# EAGLE design Super LED board (EAGLE 9.5.0)
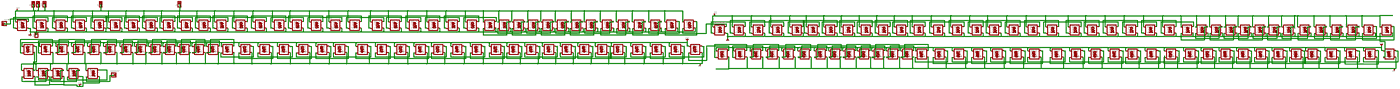
[diagram p0: schematic, sheet 1, overview]
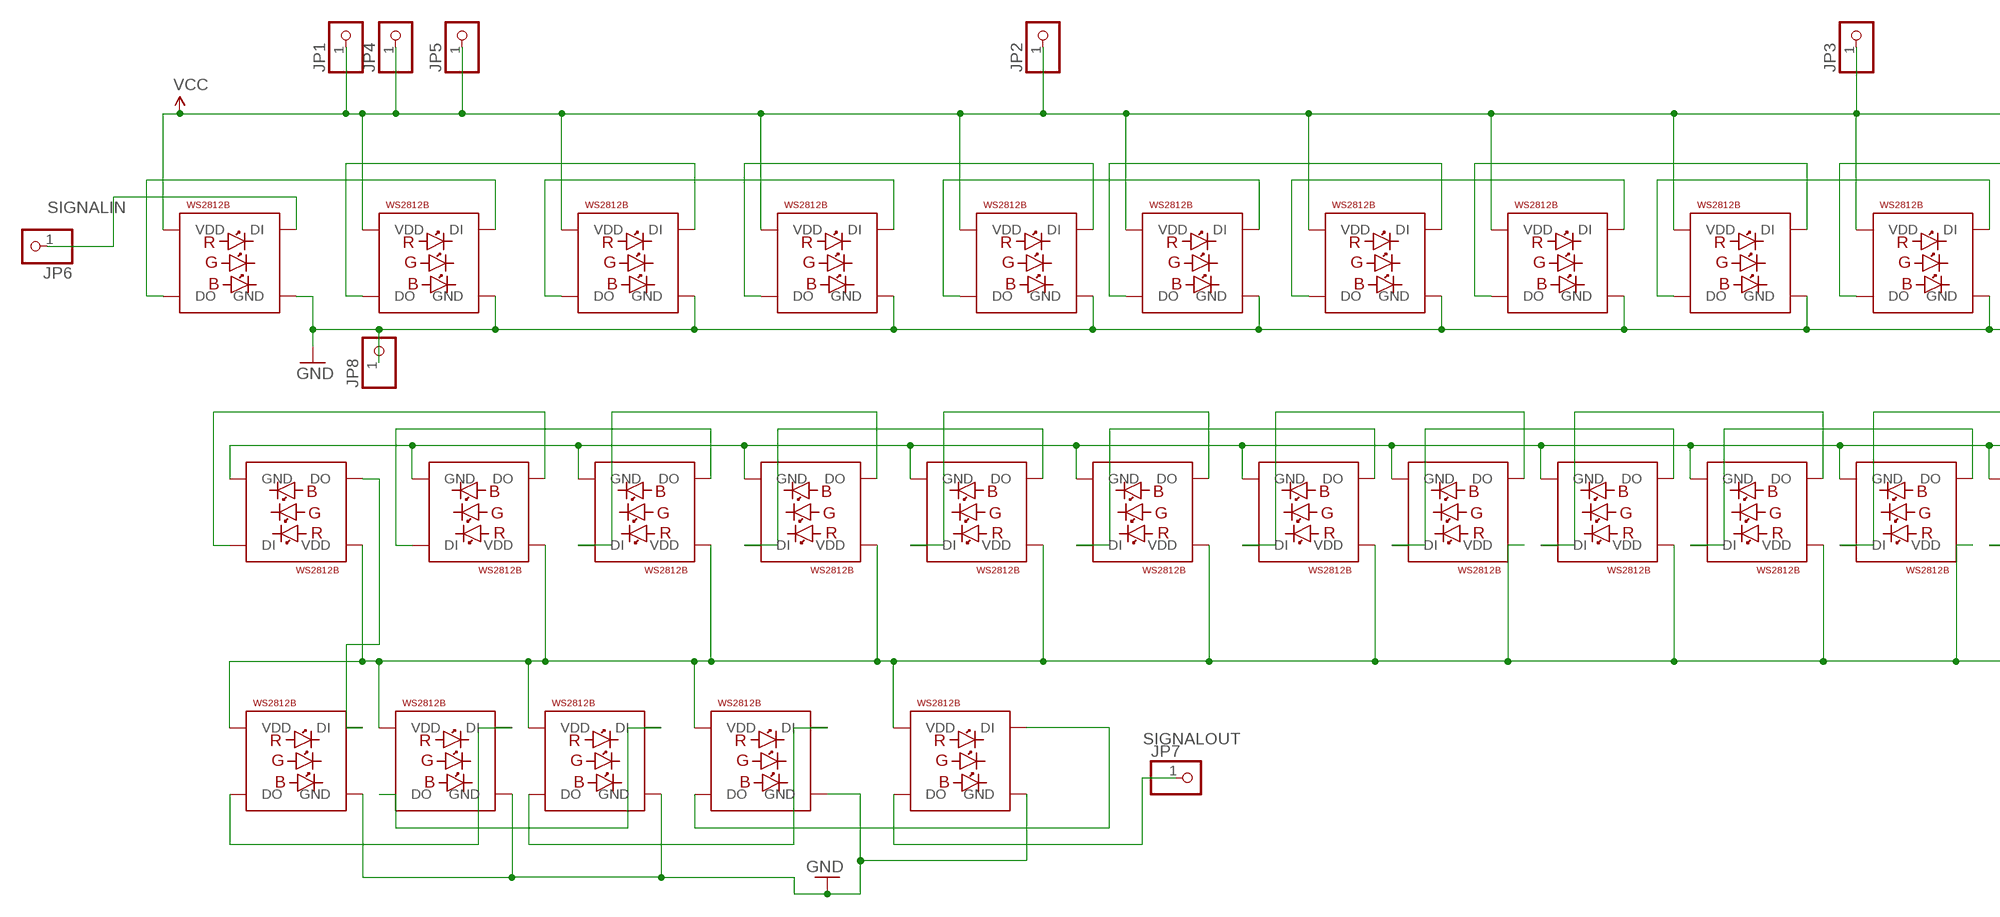
[diagram p1: schematic, sheet 1, part 1 of 8]
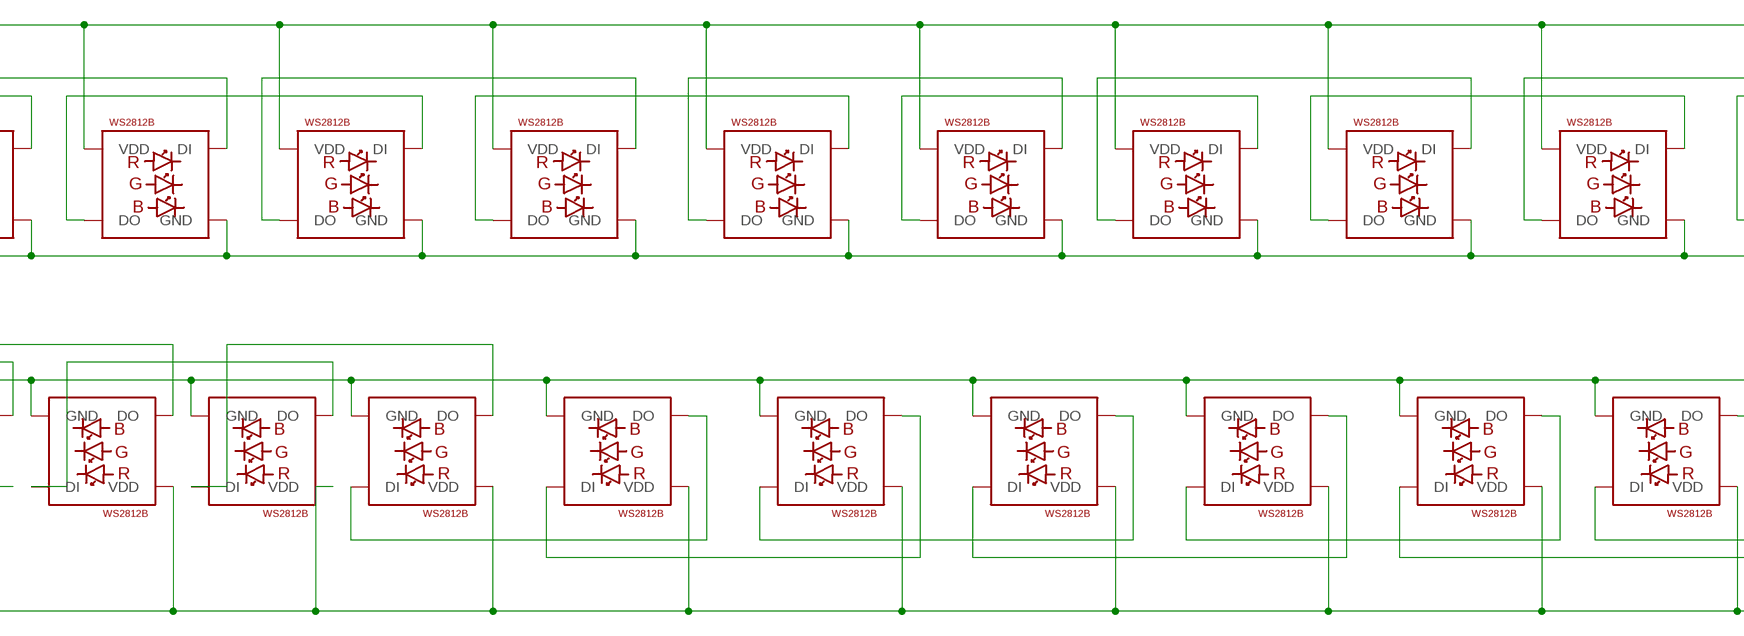
[diagram p2: schematic, sheet 1, part 2 of 8]
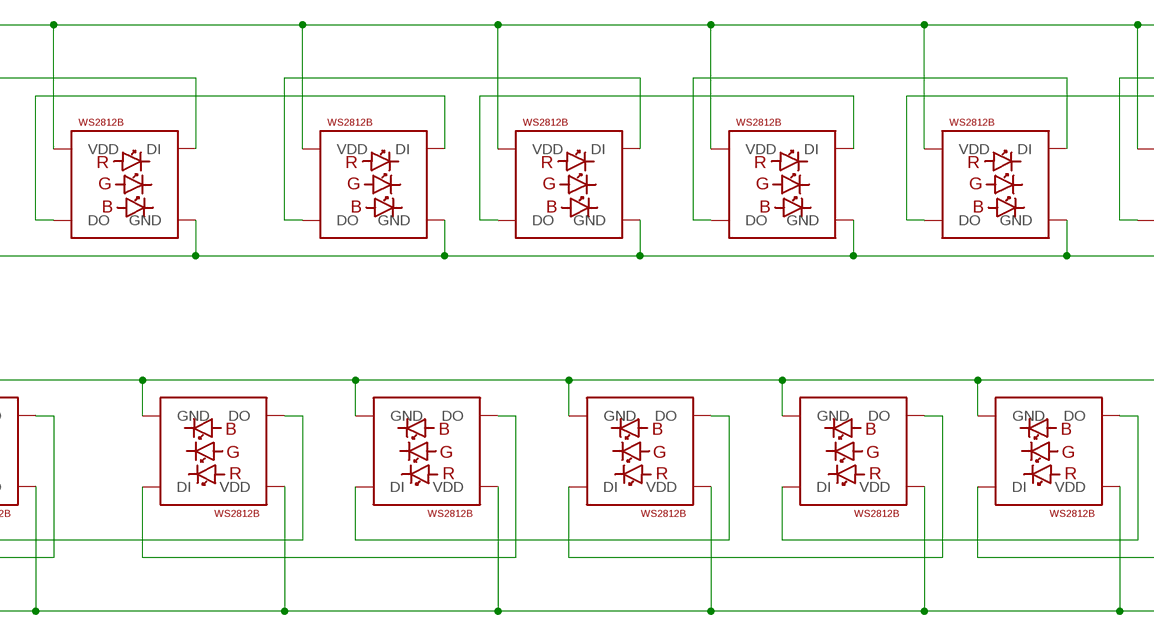
[diagram p3: schematic, sheet 1, part 3 of 8]
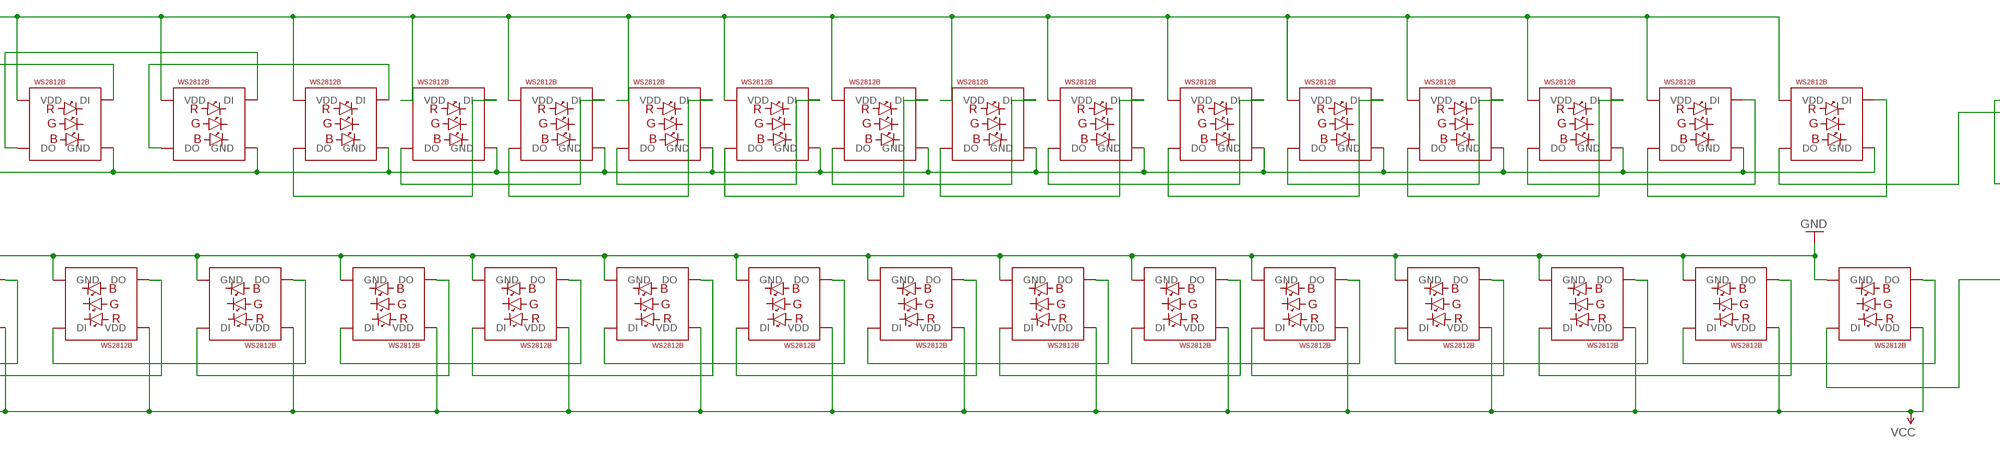
[diagram p4: schematic, sheet 1, part 4 of 8]
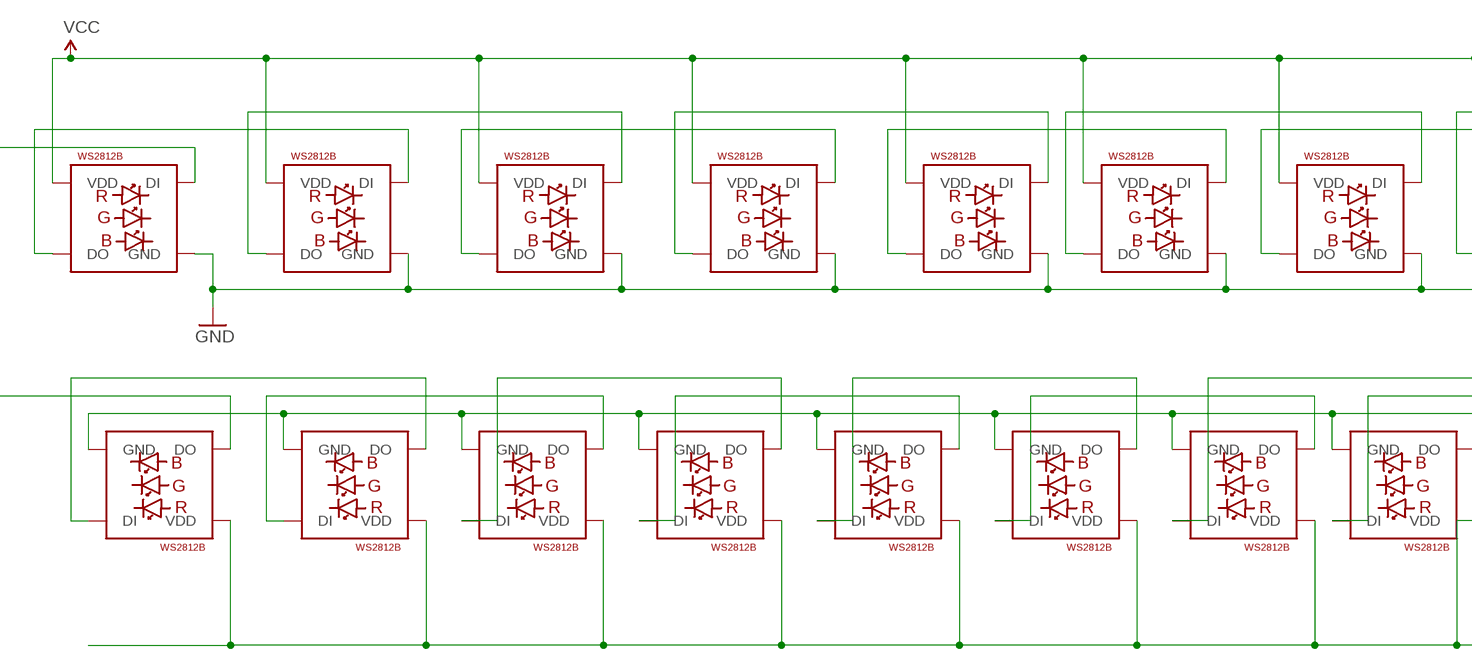
[diagram p5: schematic, sheet 1, part 5 of 8]
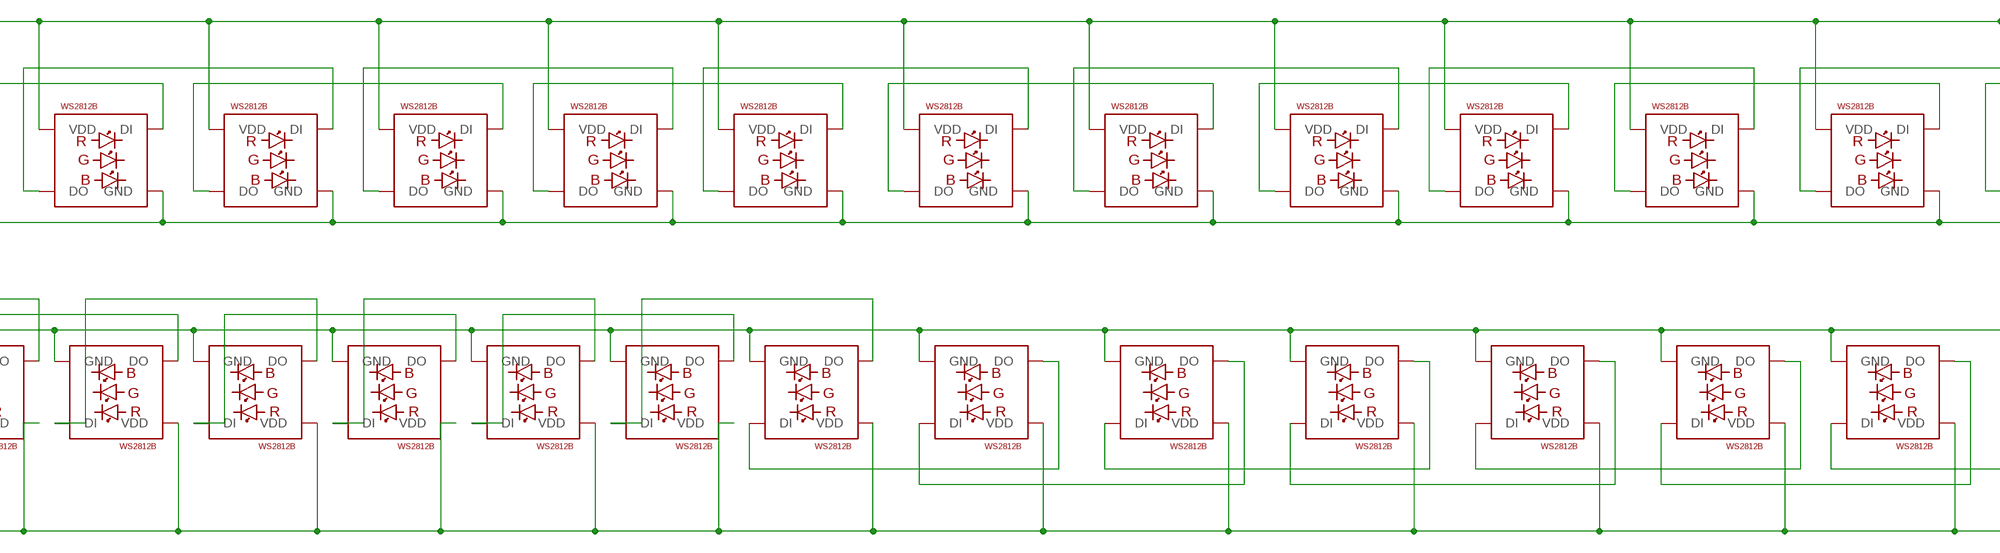
[diagram p6: schematic, sheet 1, part 6 of 8]
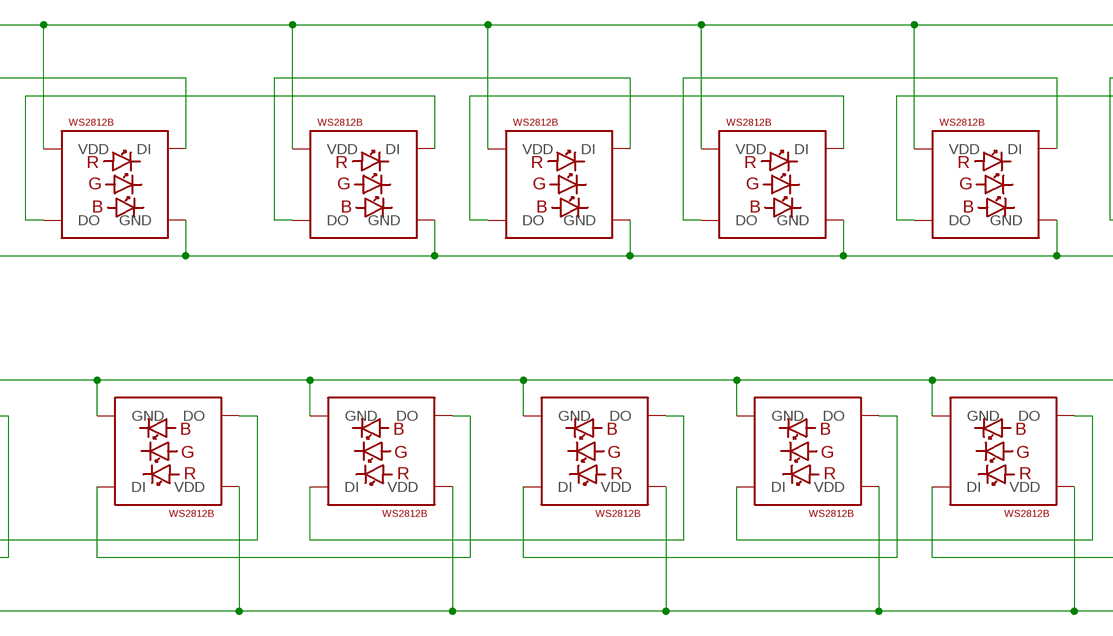
[diagram p7: schematic, sheet 1, part 7 of 8]
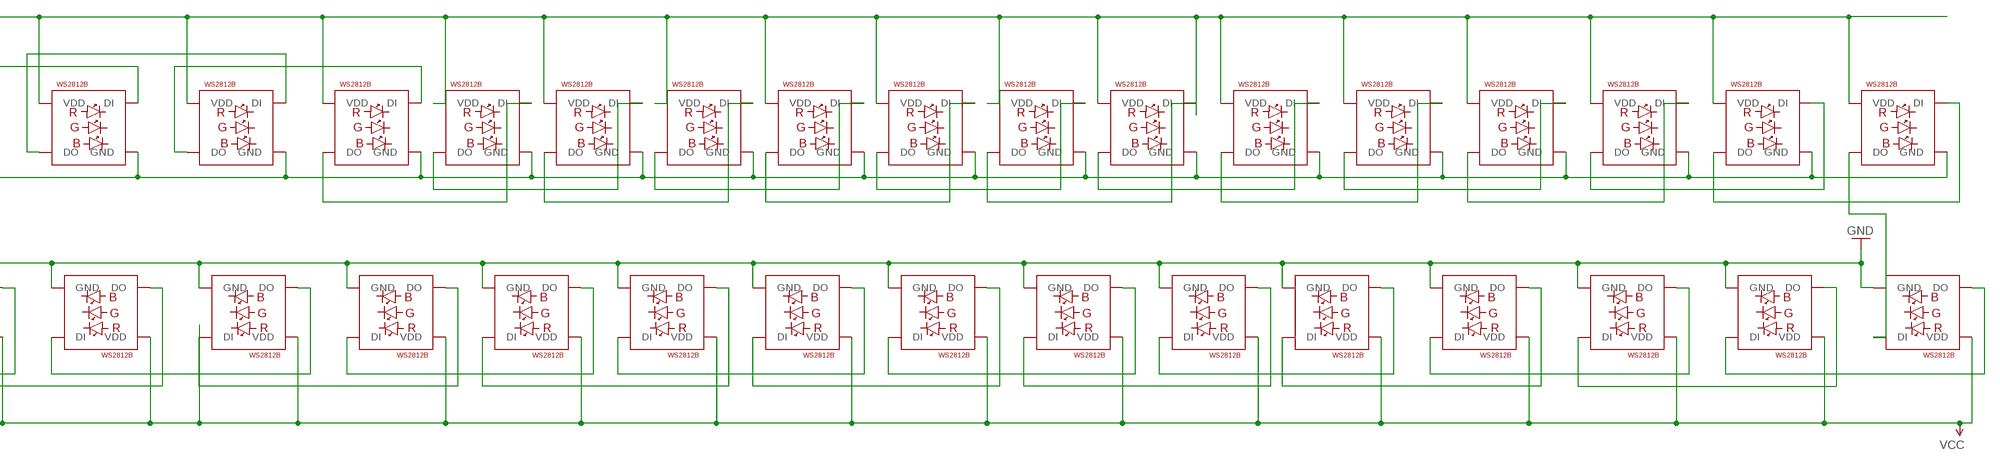
[diagram p8: schematic, sheet 1, part 8 of 8]

## Parts
JP1  PINHD-1X1  [1X01]
JP2  PINHD-1X1  [1X01]
JP3  PINHD-1X1  [1X01]
JP4  PINHD-1X1  [1X01]
JP5  PINHD-1X1  [1X01]
JP6  PINHD-1X1  [1X01]
JP7  PINHD-1X1  [1X01]
JP8  PINHD-1X1  [1X01]
LED1  WS2812B5050  [WS2812B]
LED2  WS2812B5050  [WS2812B]
LED3  WS2812B5050  [WS2812B]
LED4  WS2812B5050  [WS2812B]
LED5  WS2812B5050  [WS2812B]
LED6  WS2812B5050  [WS2812B]
LED7  WS2812B5050  [WS2812B]
LED8  WS2812B5050  [WS2812B]
LED9  WS2812B5050  [WS2812B]
LED10  WS2812B5050  [WS2812B]
LED11  WS2812B5050  [WS2812B]
LED12  WS2812B5050  [WS2812B]
LED13  WS2812B5050  [WS2812B]
LED14  WS2812B5050  [WS2812B]
LED15  WS2812B5050  [WS2812B]
LED16  WS2812B5050  [WS2812B]
LED17  WS2812B5050  [WS2812B]
LED18  WS2812B5050  [WS2812B]
LED19  WS2812B5050  [WS2812B]
LED20  WS2812B5050  [WS2812B]
LED21  WS2812B5050  [WS2812B]
LED22  WS2812B5050  [WS2812B]
LED23  WS2812B5050  [WS2812B]
LED24  WS2812B5050  [WS2812B]
LED25  WS2812B5050  [WS2812B]
LED26  WS2812B5050  [WS2812B]
LED27  WS2812B5050  [WS2812B]
LED28  WS2812B5050  [WS2812B]
LED29  WS2812B5050  [WS2812B]
LED30  WS2812B5050  [WS2812B]
LED31  WS2812B5050  [WS2812B]
LED32  WS2812B5050  [WS2812B]
LED33  WS2812B5050  [WS2812B]
LED34  WS2812B5050  [WS2812B]
LED35  WS2812B5050  [WS2812B]
LED36  WS2812B5050  [WS2812B]
LED37  WS2812B5050  [WS2812B]
LED38  WS2812B5050  [WS2812B]
LED39  WS2812B5050  [WS2812B]
LED40  WS2812B5050  [WS2812B]
LED41  WS2812B5050  [WS2812B]
LED42  WS2812B5050  [WS2812B]
LED43  WS2812B5050  [WS2812B]
LED44  WS2812B5050  [WS2812B]
LED45  WS2812B5050  [WS2812B]
LED46  WS2812B5050  [WS2812B]
LED47  WS2812B5050  [WS2812B]
LED48  WS2812B5050  [WS2812B]
LED49  WS2812B5050  [WS2812B]
LED50  WS2812B5050  [WS2812B]
LED51  WS2812B5050  [WS2812B]
LED52  WS2812B5050  [WS2812B]
LED53  WS2812B5050  [WS2812B]
LED54  WS2812B5050  [WS2812B]
LED55  WS2812B5050  [WS2812B]
LED56  WS2812B5050  [WS2812B]
LED57  WS2812B5050  [WS2812B]
LED58  WS2812B5050  [WS2812B]
LED59  WS2812B5050  [WS2812B]
LED60  WS2812B5050  [WS2812B]
LED61  WS2812B5050  [WS2812B]
LED62  WS2812B5050  [WS2812B]
LED63  WS2812B5050  [WS2812B]
LED64  WS2812B5050  [WS2812B]
LED65  WS2812B5050  [WS2812B]
LED66  WS2812B5050  [WS2812B]
LED67  WS2812B5050  [WS2812B]
LED68  WS2812B5050  [WS2812B]
LED69  WS2812B5050  [WS2812B]
LED70  WS2812B5050  [WS2812B]
LED71  WS2812B5050  [WS2812B]
LED72  WS2812B5050  [WS2812B]
LED73  WS2812B5050  [WS2812B]
LED74  WS2812B5050  [WS2812B]
LED75  WS2812B5050  [WS2812B]
LED76  WS2812B5050  [WS2812B]
LED77  WS2812B5050  [WS2812B]
LED78  WS2812B5050  [WS2812B]
LED79  WS2812B5050  [WS2812B]
LED80  WS2812B5050  [WS2812B]
LED81  WS2812B5050  [WS2812B]
LED82  WS2812B5050  [WS2812B]
LED83  WS2812B5050  [WS2812B]
LED84  WS2812B5050  [WS2812B]
LED85  WS2812B5050  [WS2812B]
LED86  WS2812B5050  [WS2812B]
LED87  WS2812B5050  [WS2812B]
LED88  WS2812B5050  [WS2812B]
LED89  WS2812B5050  [WS2812B]
LED90  WS2812B5050  [WS2812B]
LED91  WS2812B5050  [WS2812B]
LED92  WS2812B5050  [WS2812B]
LED93  WS2812B5050  [WS2812B]
LED94  WS2812B5050  [WS2812B]
LED95  WS2812B5050  [WS2812B]
LED96  WS2812B5050  [WS2812B]
LED97  WS2812B5050  [WS2812B]
LED98  WS2812B5050  [WS2812B]
LED99  WS2812B5050  [WS2812B]
LED100  WS2812B5050  [WS2812B]
LED101  WS2812B5050  [WS2812B]
LED102  WS2812B5050  [WS2812B]
LED103  WS2812B5050  [WS2812B]
LED104  WS2812B5050  [WS2812B]
LED105  WS2812B5050  [WS2812B]
LED106  WS2812B5050  [WS2812B]
LED107  WS2812B5050  [WS2812B]
LED108  WS2812B5050  [WS2812B]
LED109  WS2812B5050  [WS2812B]
LED110  WS2812B5050  [WS2812B]
LED111  WS2812B5050  [WS2812B]
LED112  WS2812B5050  [WS2812B]
LED113  WS2812B5050  [WS2812B]
LED114  WS2812B5050  [WS2812B]
LED115  WS2812B5050  [WS2812B]
LED116  WS2812B5050  [WS2812B]
LED117  WS2812B5050  [WS2812B]
LED118  WS2812B5050  [WS2812B]
LED119  WS2812B5050  [WS2812B]
LED120  WS2812B5050  [WS2812B]
LED121  WS2812B5050  [WS2812B]
LED122  WS2812B5050  [WS2812B]
LED123  WS2812B5050  [WS2812B]
LED124  WS2812B5050  [WS2812B]
LED125  WS2812B5050  [WS2812B]
LED126  WS2812B5050  [WS2812B]
LED127  WS2812B5050  [WS2812B]
LED128  WS2812B5050  [WS2812B]
LED129  WS2812B5050  [WS2812B]
LED130  WS2812B5050  [WS2812B]
LED131  WS2812B5050  [WS2812B]
LED132  WS2812B5050  [WS2812B]
LED133  WS2812B5050  [WS2812B]
LED134  WS2812B5050  [WS2812B]
LED135  WS2812B5050  [WS2812B]
LED136  WS2812B5050  [WS2812B]
LED137  WS2812B5050  [WS2812B]
LED138  WS2812B5050  [WS2812B]
LED139  WS2812B5050  [WS2812B]
LED140  WS2812B5050  [WS2812B]
LED141  WS2812B5050  [WS2812B]
LED142  WS2812B5050  [WS2812B]
LED143  WS2812B5050  [WS2812B]
LED144  WS2812B5050  [WS2812B]
LED145  WS2812B5050  [WS2812B]
LED146  WS2812B5050  [WS2812B]
LED147  WS2812B5050  [WS2812B]
LED148  WS2812B5050  [WS2812B]
LED149  WS2812B5050  [WS2812B]
LED150  WS2812B5050  [WS2812B]
LED151  WS2812B5050  [WS2812B]
LED152  WS2812B5050  [WS2812B]
LED153  WS2812B5050  [WS2812B]
LED154  WS2812B5050  [WS2812B]
LED155  WS2812B5050  [WS2812B]
LED156  WS2812B5050  [WS2812B]
LED157  WS2812B5050  [WS2812B]
LED158  WS2812B5050  [WS2812B]
LED159  WS2812B5050  [WS2812B]
LED160  WS2812B5050  [WS2812B]
LED161  WS2812B5050  [WS2812B]

## Nets
5V: JP1.1 JP2.1 JP3.1 JP4.1 JP5.1 LED1.1-VDD(VDD) LED2.1-VDD(VDD) LED3.1-VDD(VDD) LED4.1-VDD(VDD) LED5.1-VDD(VDD) LED6.1-VDD(VDD) LED7.1-VDD(VDD) LED8.1-VDD(VDD) LED9.1-VDD(VDD) LED10.1-VDD(VDD) LED11.1-VDD(VDD) LED12.1-VDD(VDD) LED13.1-VDD(VDD) LED14.1-VDD(VDD) LED15.1-VDD(VDD) LED16.1-VDD(VDD) LED17.1-VDD(VDD) LED18.1-VDD(VDD) LED19.1-VDD(VDD) LED20.1-VDD(VDD) LED21.1-VDD(VDD) LED22.1-VDD(VDD) LED23.1-VDD(VDD) LED24.1-VDD(VDD) LED25.1-VDD(VDD) LED26.1-VDD(VDD) LED27.1-VDD(VDD) LED28.1-VDD(VDD) LED29.1-VDD(VDD) LED30.1-VDD(VDD) LED31.1-VDD(VDD) LED32.1-VDD(VDD) LED33.1-VDD(VDD) LED34.1-VDD(VDD) LED35.1-VDD(VDD) LED36.1-VDD(VDD) LED37.1-VDD(VDD) LED38.1-VDD(VDD) LED39.1-VDD(VDD) LED40.1-VDD(VDD) LED41.1-VDD(VDD) LED42.1-VDD(VDD) LED43.1-VDD(VDD) LED44.1-VDD(VDD) LED45.1-VDD(VDD) LED46.1-VDD(VDD) LED47.1-VDD(VDD) LED48.1-VDD(VDD) LED49.1-VDD(VDD) LED50.1-VDD(VDD) LED51.1-VDD(VDD) LED52.1-VDD(VDD) LED53.1-VDD(VDD) LED54.1-VDD(VDD) LED55.1-VDD(VDD) LED56.1-VDD(VDD) LED57.1-VDD(VDD) LED58.1-VDD(VDD) LED59.1-VDD(VDD) LED60.1-VDD(VDD) LED61.1-VDD(VDD) LED62.1-VDD(VDD) LED63.1-VDD(VDD) LED64.1-VDD(VDD) LED65.1-VDD(VDD) LED66.1-VDD(VDD) LED67.1-VDD(VDD) LED68.1-VDD(VDD) LED69.1-VDD(VDD) LED70.1-VDD(VDD) LED71.1-VDD(VDD) LED72.1-VDD(VDD) LED73.1-VDD(VDD) LED74.1-VDD(VDD) LED75.1-VDD(VDD) LED76.1-VDD(VDD) LED77.1-VDD(VDD) LED78.1-VDD(VDD) LED79.1-VDD(VDD) LED80.1-VDD(VDD) LED81.1-VDD(VDD) LED82.1-VDD(VDD) LED83.1-VDD(VDD) LED84.1-VDD(VDD) LED85.1-VDD(VDD) LED86.1-VDD(VDD) LED87.1-VDD(VDD) LED88.1-VDD(VDD) LED89.1-VDD(VDD) LED90.1-VDD(VDD) LED91.1-VDD(VDD) LED92.1-VDD(VDD) LED93.1-VDD(VDD) LED94.1-VDD(VDD) LED95.1-VDD(VDD) LED96.1-VDD(VDD) LED97.1-VDD(VDD) LED98.1-VDD(VDD) LED99.1-VDD(VDD) LED100.1-VDD(VDD) LED101.1-VDD(VDD) LED102.1-VDD(VDD) LED103.1-VDD(VDD) LED104.1-VDD(VDD) LED105.1-VDD(VDD) LED106.1-VDD(VDD) LED107.1-VDD(VDD) LED108.1-VDD(VDD) LED109.1-VDD(VDD) LED110.1-VDD(VDD) LED111.1-VDD(VDD) LED112.1-VDD(VDD) LED113.1-VDD(VDD) LED114.1-VDD(VDD) LED115.1-VDD(VDD) LED116.1-VDD(VDD) LED117.1-VDD(VDD) LED118.1-VDD(VDD) LED119.1-VDD(VDD) LED120.1-VDD(VDD) LED121.1-VDD(VDD) LED122.1-VDD(VDD) LED123.1-VDD(VDD) LED124.1-VDD(VDD) LED125.1-VDD(VDD) LED126.1-VDD(VDD) LED127.1-VDD(VDD) LED128.1-VDD(VDD) LED129.1-VDD(VDD) LED130.1-VDD(VDD) LED131.1-VDD(VDD) LED132.1-VDD(VDD) LED133.1-VDD(VDD) LED134.1-VDD(VDD) LED135.1-VDD(VDD) LED136.1-VDD(VDD) LED137.1-VDD(VDD) LED138.1-VDD(VDD) LED139.1-VDD(VDD) LED140.1-VDD(VDD) LED141.1-VDD(VDD) LED142.1-VDD(VDD) LED143.1-VDD(VDD) LED144.1-VDD(VDD) LED145.1-VDD(VDD) LED146.1-VDD(VDD) LED147.1-VDD(VDD) LED148.1-VDD(VDD) LED149.1-VDD(VDD) LED150.1-VDD(VDD) LED151.1-VDD(VDD) LED152.1-VDD(VDD) LED153.1-VDD(VDD) LED154.1-VDD(VDD) LED155.1-VDD(VDD) LED156.1-VDD(VDD) LED157.1-VDD(VDD) LED158.1-VDD(VDD) LED159.1-VDD(VDD) LED160.1-VDD(VDD) LED161.1-VDD(VDD) ; supply symbol labelled VCC
GND: JP8.1 LED1.3-GND(GND) LED2.3-GND(GND) LED3.3-GND(GND) LED4.3-GND(GND) LED5.3-GND(GND) LED6.3-GND(GND) LED7.3-GND(GND) LED8.3-GND(GND) LED9.3-GND(GND) LED10.3-GND(GND) LED11.3-GND(GND) LED12.3-GND(GND) LED13.3-GND(GND) LED14.3-GND(GND) LED15.3-GND(GND) LED16.3-GND(GND) LED17.3-GND(GND) LED18.3-GND(GND) LED19.3-GND(GND) LED20.3-GND(GND) LED21.3-GND(GND) LED22.3-GND(GND) LED23.3-GND(GND) LED24.3-GND(GND) LED25.3-GND(GND) LED26.3-GND(GND) LED27.3-GND(GND) LED28.3-GND(GND) LED29.3-GND(GND) LED30.3-GND(GND) LED31.3-GND(GND) LED32.3-GND(GND) LED33.3-GND(GND) LED34.3-GND(GND) LED35.3-GND(GND) LED36.3-GND(GND) LED37.3-GND(GND) LED38.3-GND(GND) LED39.3-GND(GND) LED40.3-GND(GND) LED41.3-GND(GND) LED42.3-GND(GND) LED43.3-GND(GND) LED44.3-GND(GND) LED45.3-GND(GND) LED46.3-GND(GND) LED47.3-GND(GND) LED48.3-GND(GND) LED49.3-GND(GND) LED50.3-GND(GND) LED51.3-GND(GND) LED52.3-GND(GND) LED53.3-GND(GND) LED54.3-GND(GND) LED55.3-GND(GND) LED56.3-GND(GND) LED57.3-GND(GND) LED58.3-GND(GND) LED59.3-GND(GND) LED60.3-GND(GND) LED61.3-GND(GND) LED62.3-GND(GND) LED63.3-GND(GND) LED64.3-GND(GND) LED65.3-GND(GND) LED66.3-GND(GND) LED67.3-GND(GND) LED68.3-GND(GND) LED69.3-GND(GND) LED70.3-GND(GND) LED71.3-GND(GND) LED72.3-GND(GND) LED73.3-GND(GND) LED74.3-GND(GND) LED75.3-GND(GND) LED76.3-GND(GND) LED77.3-GND(GND) LED78.3-GND(GND) LED79.3-GND(GND) LED80.3-GND(GND) LED81.3-GND(GND) LED82.3-GND(GND) LED83.3-GND(GND) LED84.3-GND(GND) LED85.3-GND(GND) LED86.3-GND(GND) LED87.3-GND(GND) LED88.3-GND(GND) LED89.3-GND(GND) LED90.3-GND(GND) LED91.3-GND(GND) LED92.3-GND(GND) LED93.3-GND(GND) LED94.3-GND(GND) LED95.3-GND(GND) LED96.3-GND(GND) LED97.3-GND(GND) LED98.3-GND(GND) LED99.3-GND(GND) LED100.3-GND(GND) LED101.3-GND(GND) LED102.3-GND(GND) LED103.3-GND(GND) LED104.3-GND(GND) LED105.3-GND(GND) LED106.3-GND(GND) LED107.3-GND(GND) LED108.3-GND(GND) LED109.3-GND(GND) LED110.3-GND(GND) LED111.3-GND(GND) LED112.3-GND(GND) LED113.3-GND(GND) LED114.3-GND(GND) LED115.3-GND(GND) LED116.3-GND(GND) LED117.3-GND(GND) LED118.3-GND(GND) LED119.3-GND(GND) LED120.3-GND(GND) LED121.3-GND(GND) LED122.3-GND(GND) LED123.3-GND(GND) LED124.3-GND(GND) LED125.3-GND(GND) LED126.3-GND(GND) LED127.3-GND(GND) LED128.3-GND(GND) LED129.3-GND(GND) LED130.3-GND(GND) LED131.3-GND(GND) LED132.3-GND(GND) LED133.3-GND(GND) LED134.3-GND(GND) LED135.3-GND(GND) LED136.3-GND(GND) LED137.3-GND(GND) LED138.3-GND(GND) LED139.3-GND(GND) LED140.3-GND(GND) LED141.3-GND(GND) LED142.3-GND(GND) LED143.3-GND(GND) LED144.3-GND(GND) LED145.3-GND(GND) LED146.3-GND(GND) LED147.3-GND(GND) LED148.3-GND(GND) LED149.3-GND(GND) LED150.3-GND(GND) LED151.3-GND(GND) LED152.3-GND(GND) LED153.3-GND(GND) LED154.3-GND(GND) LED155.3-GND(GND) LED156.3-GND(GND) LED157.3-GND(GND) LED158.3-GND(GND) LED159.3-GND(GND) LED160.3-GND(GND) LED161.3-GND(GND)
N$1: LED5.2-DOUT(DO) LED6.4-DIN(DI)
N$2: LED1.2-DOUT(DO) LED2.4-DIN(DI)
N$3: LED2.2-DOUT(DO) LED3.4-DIN(DI)
N$4: LED3.2-DOUT(DO) LED4.4-DIN(DI)
N$5: LED4.2-DOUT(DO) LED5.4-DIN(DI)
N$6: LED6.2-DOUT(DO) LED7.4-DIN(DI)
N$7: LED7.2-DOUT(DO) LED8.4-DIN(DI)
N$8: LED8.2-DOUT(DO) LED9.4-DIN(DI)
N$9: LED9.2-DOUT(DO) LED10.4-DIN(DI)
N$10: LED10.2-DOUT(DO) LED11.4-DIN(DI)
N$11: LED11.2-DOUT(DO) LED12.4-DIN(DI)
N$12: LED12.2-DOUT(DO) LED13.4-DIN(DI)
N$13: LED13.2-DOUT(DO) LED14.4-DIN(DI)
N$14: LED14.2-DOUT(DO) LED15.4-DIN(DI)
N$15: LED15.2-DOUT(DO) LED16.4-DIN(DI)
N$16: LED16.2-DOUT(DO) LED17.4-DIN(DI)
N$17: LED17.2-DOUT(DO) LED18.4-DIN(DI)
N$18: LED18.2-DOUT(DO) LED19.4-DIN(DI)
N$19: LED19.2-DOUT(DO) LED20.4-DIN(DI)
N$20: LED20.2-DOUT(DO) LED21.4-DIN(DI)
N$21: LED21.2-DOUT(DO) LED22.4-DIN(DI)
N$22: LED22.2-DOUT(DO) LED23.4-DIN(DI)
N$23: LED23.2-DOUT(DO) LED24.4-DIN(DI)
N$24: LED24.2-DOUT(DO) LED25.4-DIN(DI)
N$25: LED25.2-DOUT(DO) LED26.4-DIN(DI)
N$26: LED26.2-DOUT(DO) LED27.4-DIN(DI)
N$27: LED27.2-DOUT(DO) LED28.4-DIN(DI)
N$28: LED28.2-DOUT(DO) LED29.4-DIN(DI)
N$29: LED29.2-DOUT(DO) LED30.4-DIN(DI)
N$30: LED30.2-DOUT(DO) LED31.4-DIN(DI)
N$31: LED31.2-DOUT(DO) LED32.4-DIN(DI)
N$32: LED32.2-DOUT(DO) LED33.4-DIN(DI)
N$33: LED33.2-DOUT(DO) LED34.4-DIN(DI)
N$34: LED34.2-DOUT(DO) LED35.4-DIN(DI)
N$35: LED35.2-DOUT(DO) LED36.4-DIN(DI)
N$36: LED36.2-DOUT(DO) LED37.4-DIN(DI)
N$37: LED37.2-DOUT(DO) LED38.4-DIN(DI)
N$38: LED38.2-DOUT(DO) LED39.4-DIN(DI)
N$39: LED40.2-DOUT(DO) LED41.4-DIN(DI)
N$40: LED42.2-DOUT(DO) LED43.4-DIN(DI)
N$41: LED43.2-DOUT(DO) LED44.4-DIN(DI)
N$42: LED44.2-DOUT(DO) LED45.4-DIN(DI)
N$43: LED45.2-DOUT(DO) LED46.4-DIN(DI)
N$44: LED46.2-DOUT(DO) LED47.4-DIN(DI)
N$45: LED47.2-DOUT(DO) LED48.4-DIN(DI)
N$46: LED48.2-DOUT(DO) LED49.4-DIN(DI)
N$47: LED49.2-DOUT(DO) LED50.4-DIN(DI)
N$48: LED50.2-DOUT(DO) LED51.4-DIN(DI)
N$49: LED51.2-DOUT(DO) LED52.4-DIN(DI)
N$50: LED52.2-DOUT(DO) LED53.4-DIN(DI)
N$51: LED53.2-DOUT(DO) LED54.4-DIN(DI)
N$52: LED54.2-DOUT(DO) LED55.4-DIN(DI)
N$53: LED55.2-DOUT(DO) LED56.4-DIN(DI)
N$54: LED56.2-DOUT(DO) LED57.4-DIN(DI)
N$55: LED57.2-DOUT(DO) LED58.4-DIN(DI)
N$56: LED58.2-DOUT(DO) LED59.4-DIN(DI)
N$57: LED59.2-DOUT(DO) LED60.4-DIN(DI)
N$58: LED60.2-DOUT(DO) LED61.4-DIN(DI)
N$59: LED61.2-DOUT(DO) LED62.4-DIN(DI)
N$60: LED62.2-DOUT(DO) LED63.4-DIN(DI)
N$61: LED63.2-DOUT(DO) LED64.4-DIN(DI)
N$62: LED64.2-DOUT(DO) LED65.4-DIN(DI)
N$63: LED41.2-DOUT(DO) LED42.4-DIN(DI)
N$64: LED65.2-DOUT(DO) LED66.4-DIN(DI)
N$65: LED66.2-DOUT(DO) LED67.4-DIN(DI)
N$66: LED67.2-DOUT(DO) LED68.4-DIN(DI)
N$67: LED68.2-DOUT(DO) LED69.4-DIN(DI)
N$68: LED69.2-DOUT(DO) LED70.4-DIN(DI)
N$69: LED70.2-DOUT(DO) LED71.4-DIN(DI)
N$70: LED71.2-DOUT(DO) LED72.4-DIN(DI)
N$71: LED72.2-DOUT(DO) LED73.4-DIN(DI)
N$72: LED73.2-DOUT(DO) LED74.4-DIN(DI)
N$73: LED74.2-DOUT(DO) LED75.4-DIN(DI)
N$74: LED75.2-DOUT(DO) LED76.4-DIN(DI)
N$75: LED76.2-DOUT(DO) LED77.4-DIN(DI)
N$76: LED77.2-DOUT(DO) LED78.4-DIN(DI)
N$77: LED39.2-DOUT(DO) LED40.4-DIN(DI)
N$78: LED79.2-DOUT(DO) LED80.4-DIN(DI)
N$79: LED81.2-DOUT(DO) LED82.4-DIN(DI)
N$80: LED82.2-DOUT(DO) LED83.4-DIN(DI)
N$81: LED83.2-DOUT(DO) LED84.4-DIN(DI)
N$82: LED84.2-DOUT(DO) LED85.4-DIN(DI)
N$83: LED85.2-DOUT(DO) LED86.4-DIN(DI)
N$84: LED86.2-DOUT(DO) LED87.4-DIN(DI)
N$85: LED87.2-DOUT(DO) LED88.4-DIN(DI)
N$86: LED88.2-DOUT(DO) LED89.4-DIN(DI)
N$87: LED89.2-DOUT(DO) LED90.4-DIN(DI)
N$88: LED90.2-DOUT(DO) LED91.4-DIN(DI)
N$89: LED91.2-DOUT(DO) LED92.4-DIN(DI)
N$90: LED92.2-DOUT(DO) LED93.4-DIN(DI)
N$91: LED93.2-DOUT(DO) LED94.4-DIN(DI)
N$92: LED94.2-DOUT(DO) LED95.4-DIN(DI)
N$93: LED95.2-DOUT(DO) LED96.4-DIN(DI)
N$94: LED96.2-DOUT(DO) LED97.4-DIN(DI)
N$95: LED97.2-DOUT(DO) LED98.4-DIN(DI)
N$96: LED98.2-DOUT(DO) LED99.4-DIN(DI)
N$97: LED99.2-DOUT(DO) LED100.4-DIN(DI)
N$98: LED100.2-DOUT(DO) LED101.4-DIN(DI)
N$99: LED101.2-DOUT(DO) LED102.4-DIN(DI)
N$100: LED102.2-DOUT(DO) LED103.4-DIN(DI)
N$101: LED103.2-DOUT(DO) LED104.4-DIN(DI)
N$102: LED80.2-DOUT(DO) LED81.4-DIN(DI)
N$103: LED104.2-DOUT(DO) LED105.4-DIN(DI)
N$104: LED105.2-DOUT(DO) LED106.4-DIN(DI)
N$105: LED106.2-DOUT(DO) LED107.4-DIN(DI)
N$106: LED107.2-DOUT(DO) LED108.4-DIN(DI)
N$107: LED108.2-DOUT(DO) LED109.4-DIN(DI)
N$108: LED109.2-DOUT(DO) LED110.4-DIN(DI)
N$109: LED110.2-DOUT(DO) LED111.4-DIN(DI)
N$110: LED111.2-DOUT(DO) LED112.4-DIN(DI)
N$111: LED112.2-DOUT(DO) LED113.4-DIN(DI)
N$112: LED113.2-DOUT(DO) LED114.4-DIN(DI)
N$113: LED114.2-DOUT(DO) LED115.4-DIN(DI)
N$114: LED115.2-DOUT(DO) LED116.4-DIN(DI)
N$115: LED116.2-DOUT(DO) LED117.4-DIN(DI)
N$116: LED78.2-DOUT(DO) LED79.4-DIN(DI)
N$117: LED118.2-DOUT(DO) LED119.4-DIN(DI)
N$118: LED120.2-DOUT(DO) LED121.4-DIN(DI)
N$119: LED121.2-DOUT(DO) LED122.4-DIN(DI)
N$120: LED122.2-DOUT(DO) LED123.4-DIN(DI)
N$121: LED123.2-DOUT(DO) LED124.4-DIN(DI)
N$122: LED124.2-DOUT(DO) LED125.4-DIN(DI)
N$123: LED125.2-DOUT(DO) LED126.4-DIN(DI)
N$124: LED126.2-DOUT(DO) LED127.4-DIN(DI)
N$125: LED127.2-DOUT(DO) LED128.4-DIN(DI)
N$126: LED128.2-DOUT(DO) LED129.4-DIN(DI)
N$127: LED129.2-DOUT(DO) LED130.4-DIN(DI)
N$128: LED130.2-DOUT(DO) LED131.4-DIN(DI)
N$129: LED131.2-DOUT(DO) LED132.4-DIN(DI)
N$130: LED132.2-DOUT(DO) LED133.4-DIN(DI)
N$131: LED133.2-DOUT(DO) LED134.4-DIN(DI)
N$132: LED134.2-DOUT(DO) LED135.4-DIN(DI)
N$133: LED135.2-DOUT(DO) LED136.4-DIN(DI)
N$134: LED136.2-DOUT(DO) LED137.4-DIN(DI)
N$135: LED137.2-DOUT(DO) LED138.4-DIN(DI)
N$136: LED138.2-DOUT(DO) LED139.4-DIN(DI)
N$137: LED139.2-DOUT(DO) LED140.4-DIN(DI)
N$138: LED140.2-DOUT(DO) LED141.4-DIN(DI)
N$139: LED141.2-DOUT(DO) LED142.4-DIN(DI)
N$140: LED142.2-DOUT(DO) LED143.4-DIN(DI)
N$141: LED119.2-DOUT(DO) LED120.4-DIN(DI)
N$142: LED143.2-DOUT(DO) LED144.4-DIN(DI)
N$143: LED144.2-DOUT(DO) LED145.4-DIN(DI)
N$144: LED145.2-DOUT(DO) LED146.4-DIN(DI)
N$145: LED146.2-DOUT(DO) LED147.4-DIN(DI)
N$146: LED147.2-DOUT(DO) LED148.4-DIN(DI)
N$147: LED148.2-DOUT(DO) LED149.4-DIN(DI)
N$148: LED149.2-DOUT(DO) LED150.4-DIN(DI)
N$149: LED150.2-DOUT(DO) LED151.4-DIN(DI)
N$150: LED151.2-DOUT(DO) LED152.4-DIN(DI)
N$151: LED152.2-DOUT(DO) LED153.4-DIN(DI)
N$152: LED153.2-DOUT(DO) LED154.4-DIN(DI)
N$153: LED154.2-DOUT(DO) LED155.4-DIN(DI)
N$154: LED155.2-DOUT(DO) LED156.4-DIN(DI)
N$155: LED117.2-DOUT(DO) LED118.4-DIN(DI)
N$156: LED160.2-DOUT(DO) LED161.4-DIN(DI)
N$157: LED156.2-DOUT(DO) LED157.4-DIN(DI)
N$158: LED157.2-DOUT(DO) LED158.4-DIN(DI)
N$159: LED158.2-DOUT(DO) LED159.4-DIN(DI)
N$160: LED159.2-DOUT(DO) LED160.4-DIN(DI)
SIGNALIN: JP6.1 LED1.4-DIN(DI)
SIGNALOUT: JP7.1 LED161.2-DOUT(DO)

## Library data of the parts
JP1-JP8 = adafruit:PINHD-1X1: Pin header 1x1 for 0.1" spacing With round pins
LED1-LED161 = freetronics-jon:WS2812B

## Board
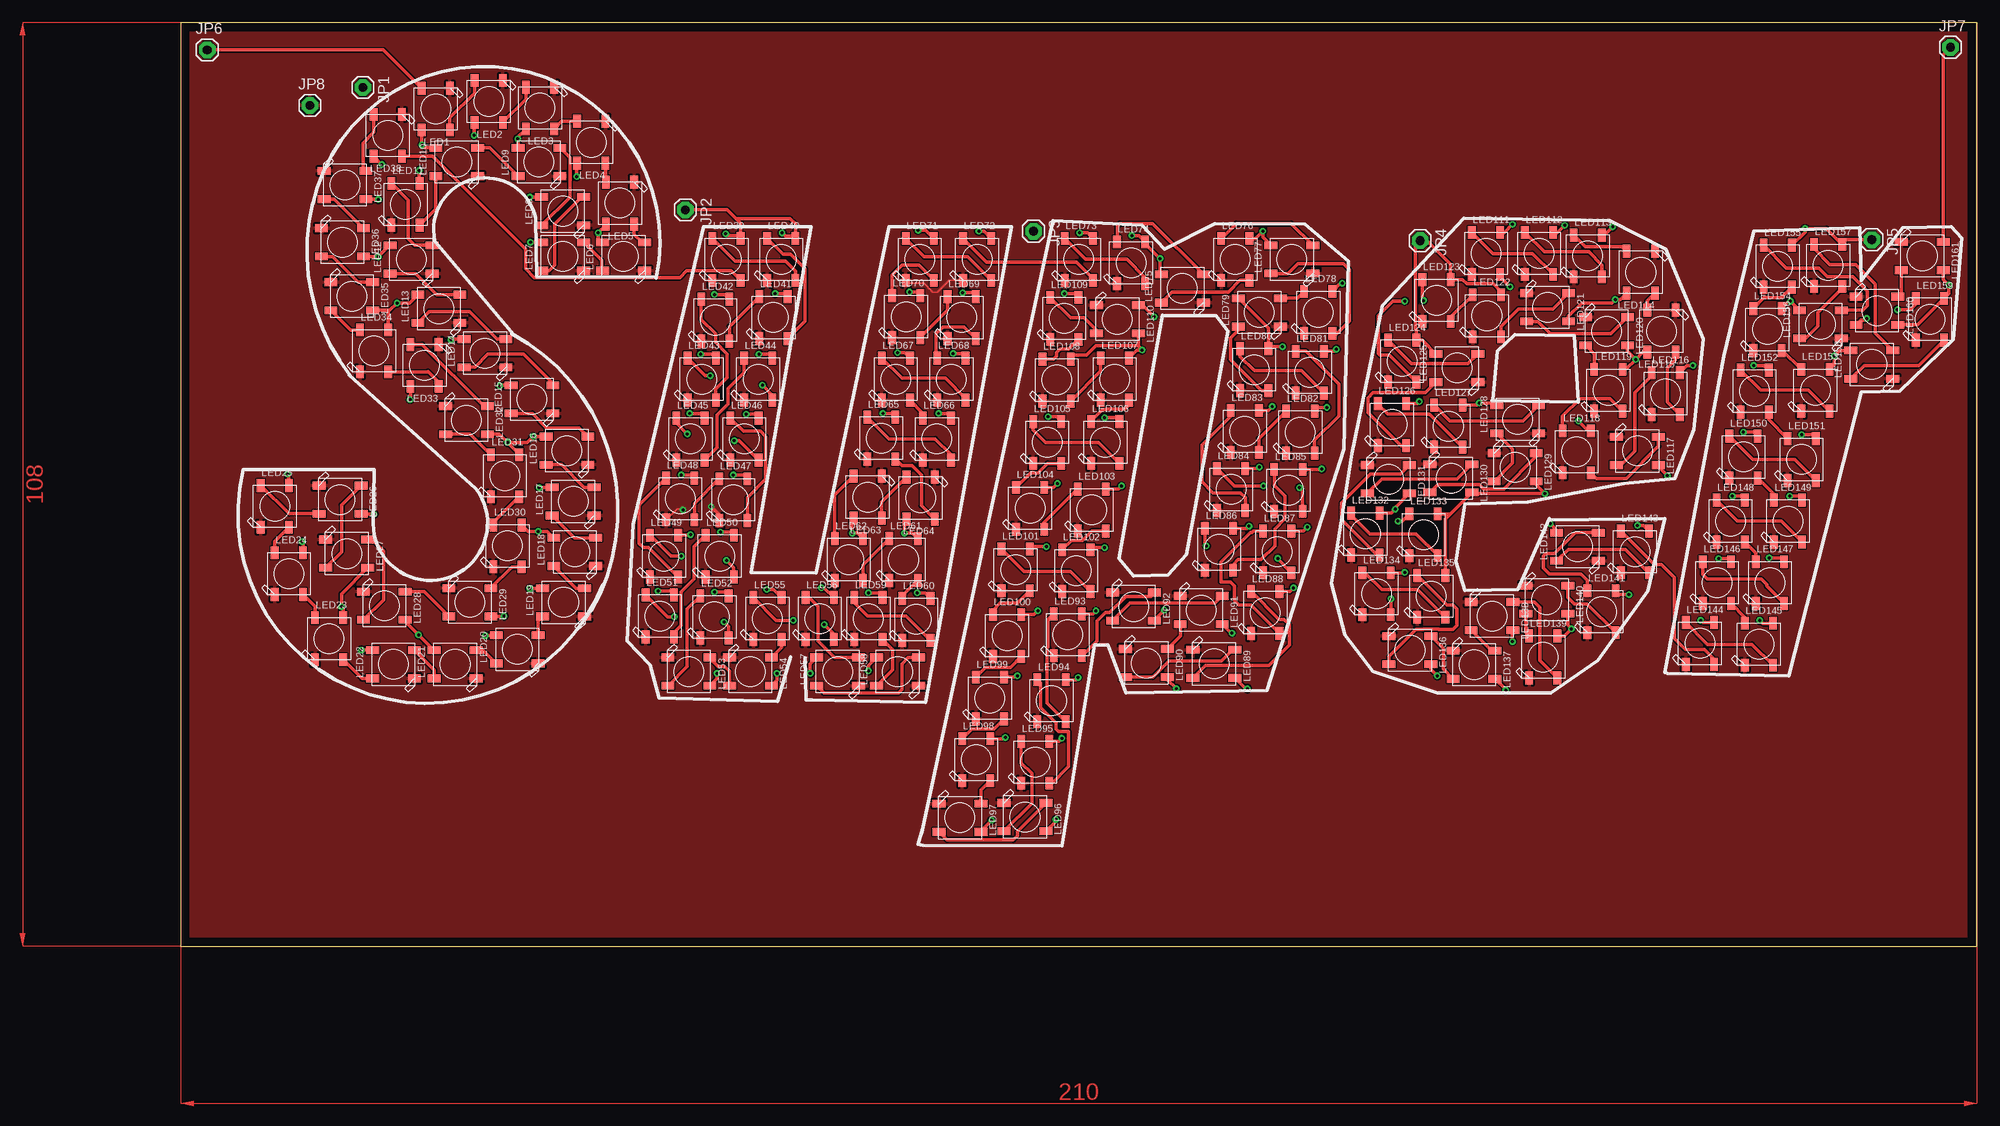
[diagram p9: board, top side]
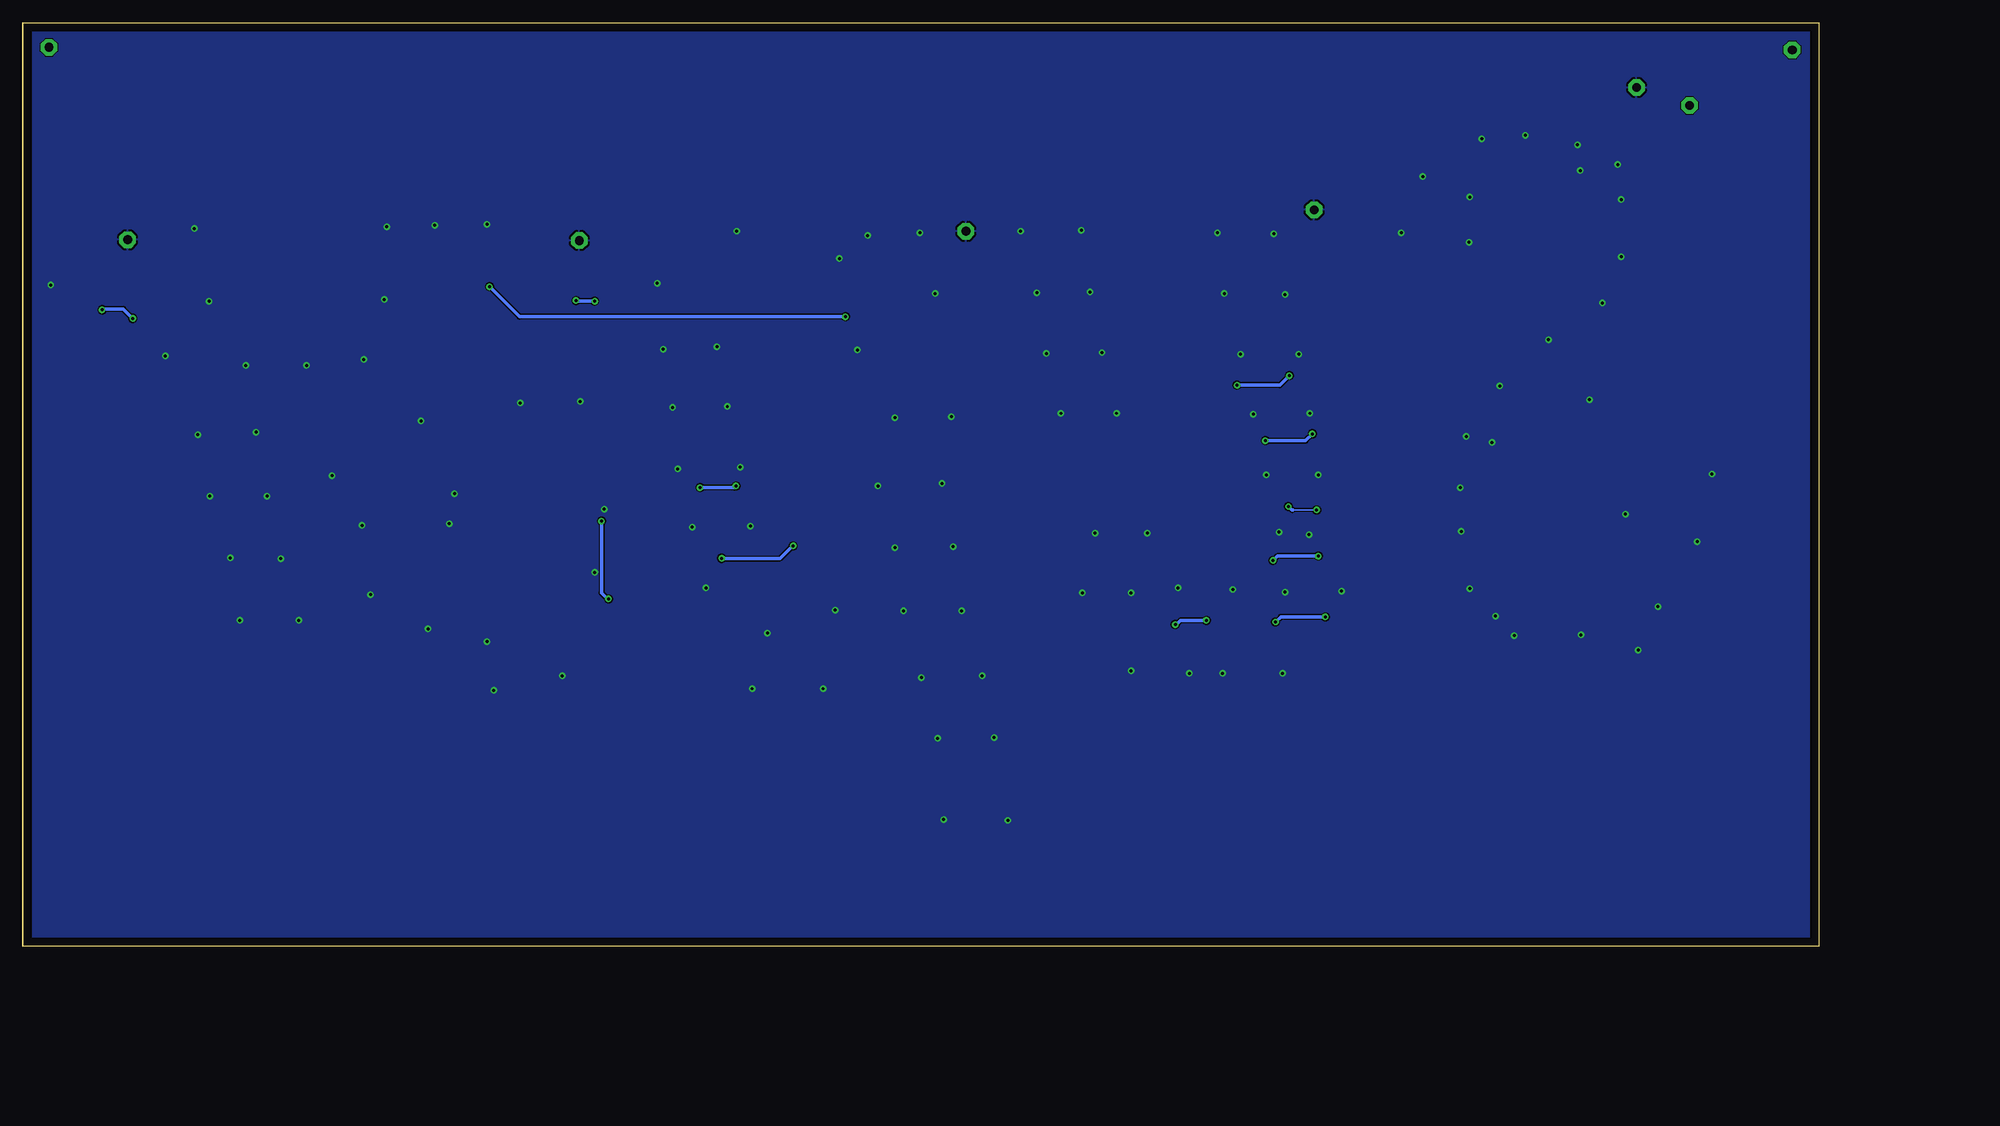
[diagram p10: board, bottom side, seen from below]

Size 210 x 108 mm. Coordinates in mm from the lower left corner, seen from the top.
Outline: 0,0 210,0 210,108 0,108 0,0
Copper layers (1*16): Top 0.035mm / dielectric 1.5mm / Bottom 0.035mm
Design rules "default": minimum track width 6mil, minimum drill 0.35mm, track to track 6mil, track to pad 6mil, pad to pad 6mil, via to via 6mil, smd to smd 6mil, copper to edge 40mil, drill to drill 6mil, minimum pad ring 10mil, minimum via ring 8mil, stop-mask expansion 4mil, vias tented up to drill 0mil, thermal gap 10mil

### Footprints (pad centres in the part's own frame; a part is rotated, then mirrored left to right if it is on the bottom)
1X01 = drill 1.016 pad 1.93 octagon: 1 0,0
WS2812B = smd 1.5 x 0.9: 1-VDD 2.45,-1.65; 2-DOUT 2.45,1.65; 3-GND -2.45,1.65; 4-DIN -2.45,-1.65

### Placement (x,y rotation side)
JP1  21.3,100.4 270 top
JP2  59,86.1 270 top
JP3  99.7,83.6 270 top
JP4  144.9,82.5 270 top
JP5  197.7,82.6 270 top
JP6  3.1,104.8 0 top
JP7  206.9,105.1 0 top
JP8  15.1,98.3 0 top
LED1  29.81,97.88 270 top
LED2  36.01,98.77 270 top
LED3  42,98 270 top
LED4  48,94 270 top
LED5  51.36,86.88 270 top
LED6  51.77,80.64 180 top
LED7  44.66,80.64 180 top
LED8  44.65,85.94 180 top
LED9  41.88,91.69 180 top
LED10  32.27,91.69 180 top
LED11  26.29,86.74 90 top
LED12  26.95,80.29 180 top
LED13  30.18,74.54 180 top
LED14  35.57,69.34 180 top
LED15  41.06,63.94 180 top
LED16  45.15,57.94 180 top
LED17  45.88,51.99 180 top
LED18  46.07,46.09 180 top
LED19  44.76,40.19 180 top
LED20  39.35,34.69 180 top
LED21  32.08,32.94 180 top
LED22  24.87,32.94 180 top
LED23  17.34,35.94 90 top
LED24  12.64,43.55 90 top
LED25  10.99,51.42 90 top
LED26  18.63,52.21 0 top
LED27  19.4,45.9 0 top
LED28  23.8,39.8 0 top
LED29  33.8,40.2 0 top
LED30  38.2,46.8 90 top
LED31  37.9,55 90 top
LED32  33.4,61.5 0 top
LED33  28.5,67.9 270 top
LED34  22.6,69.6 90 top
LED35  20,76 0 top
LED36  18.9,82.3 0 top
LED37  19.2,89 0 top
LED38  24.2,94.8 270 top
LED39  63.8,80.3 90 top
LED40  70.2,80.3 90 top
LED41  69.3,73.5 90 top
LED42  62.5,73.2 90 top
LED43  60.9,66.3 90 top
LED44  67.5,66.3 90 top
LED45  59.6,59.3 90 top
LED46  65.9,59.3 90 top
LED47  64.6,52.2 90 top
LED48  58.4,52.3 90 top
LED49  56.5,45.6 90 top
LED50  63,45.6 90 top
LED51  56,38.6 90 top
LED52  62.4,38.5 90 top
LED53  59.4,32.1 0 top
LED54  66.6,32.1 0 top
LED55  68.6,38.3 90 top
LED56  74.7,38.3 90 top
LED57  76.8,32.1 180 top
LED58  83.8,32.1 180 top
LED59  80.4,38.3 90 top
LED60  86,38.2 90 top
LED61  84.5,45.2 90 top
LED62  78.1,45.2 90 top
LED63  80.3,52.5 270 top
LED64  86.5,52.4 270 top
LED65  81.9,59.4 90 top
LED66  88.4,59.3 90 top
LED67  83.6,66.3 90 top
LED68  90.1,66.3 90 top
LED69  91.3,73.5 90 top
LED70  84.8,73.6 90 top
LED71  86.4,80.3 90 top
LED72  93.1,80.3 90 top
LED73  105,80.3 90 top
LED74  111.1,79.9 90 top
LED75  117.1,76.9 180 top
LED76  123.3,80.3 90 top
LED77  129.9,80.3 180 top
LED78  133,74.1 90 top
LED79  126.1,74.1 180 top
LED80  125.5,67.4 90 top
LED81  132,67.1 90 top
LED82  130.9,60.1 90 top
LED83  124.4,60.2 90 top
LED84  122.8,53.4 90 top
LED85  129.5,53.3 90 top
LED86  121.4,46.4 90 top
LED87  128.2,46.1 90 top
LED88  126.8,39 90 top
LED89  120.8,33 0 top
LED90  112.9,33.1 0 top
LED91  119.3,39.3 0 top
LED92  111.4,39.7 0 top
LED93  103.7,36.4 90 top
LED94  101.8,28.7 90 top
LED95  99.9,21.5 90 top
LED96  98.7,15.1 0 top
LED97  91.1,15 0 top
LED98  93,21.8 90 top
LED99  94.6,29 90 top
LED100  96.6,36.3 90 top
LED101  97.6,44 90 top
LED102  104.7,43.9 90 top
LED103  106.5,51 90 top
LED104  99.3,51.2 90 top
LED105  101.3,58.9 90 top
LED106  108.1,58.9 90 top
LED107  109.2,66.3 90 top
LED108  102.4,66.2 90 top
LED109  103.3,73.4 90 top
LED110  109.5,73.3 0 top
LED111  152.6,81 90 top
LED112  158.8,81 90 top
LED113  164.5,80.7 90 top
LED114  170.7,78.8 270 top
LED115  173.1,71.9 270 top
LED116  173.6,64.6 90 top
LED117  170.3,57.9 0 top
LED118  163.2,57.8 90 top
LED119  166.9,65 90 top
LED120  166.7,71.9 0 top
LED121  159.8,74.7 0 top
LED122  152.7,73.7 90 top
LED123  146.8,75.5 90 top
LED124  142.8,68.4 90 top
LED125  149.2,67.6 180 top
LED126  141.6,61 90 top
LED127  148.2,60.8 90 top
LED128  156.3,61.6 180 top
LED129  156,56 0 top
LED130  148.5,54.7 0 top
LED131  141.2,54.6 0 top
LED132  138.5,48.2 90 top
LED133  145.3,48.1 90 top
LED134  139.8,41.2 90 top
LED135  146.2,40.9 90 top
LED136  143.7,34.6 0 top
LED137  151.2,32.9 0 top
LED138  153.3,38.6 0 top
LED139  159.3,33.8 90 top
LED140  159.7,40.5 0 top
LED141  166.1,39.1 90 top
LED142  163.3,46.7 180 top
LED143  170,46.1 90 top
LED144  177.6,35.4 90 top
LED145  184.5,35.3 90 top
LED146  179.6,42.5 90 top
LED147  185.8,42.5 90 top
LED148  181.2,49.7 90 top
LED149  187.9,49.7 90 top
LED150  182.7,57.2 90 top
LED151  189.5,56.9 90 top
LED152  184,64.9 90 top
LED153  191.1,65 90 top
LED154  185.5,72.1 90 top
LED155  186.7,79.5 90 top
LED156  191.7,72.7 180 top
LED157  192.6,79.6 90 top
LED158  197.7,68 180 top
LED159  204.5,73.3 90 top
LED160  198.3,74.3 0 top
LED161  203.6,80.7 0 top

### Tracks (layer width: path | path; a pad name or v marks a point on that pad's centre or on a via)
5V  (via drill 0.35)
  Top 0.406: LED4.1-VDD 46.3,91.5 v46.3,90 | LED34.1-VDD 24.25,74.15 24.45,74.35 | LED35.1-VDD 24.45,74.35 | LED13.1-VDD 26.74,75.2 v25.3,75.2 24.45,74.35 | LED21.1-VDD 29.61,34.59 v27.8,36.4 26.25,37.95 LED28.1-VDD | LED39.1-VDD 65.45,83.1 | 65.45,83.1 65.45,84.55 64.95,85.05 | 64.95,85.05 63.9,86.1 JP2.1 | LED40.1-VDD 71.85,83 | 71.85,83 71.85,84.45 71.25,85.05 64.95,85.05 | LED5.1-VDD 49.71,84.31 v48.8,83.4 48.8,82.81 LED6.1-VDD | v40.9,82.3 v40.91,82.29 LED7.1-VDD | v40.8,87.6 LED8.1-VDD | LED9.1-VDD 39.43,94.37 v39.4,94.4 39.4,94.6 LED3.1-VDD | LED10.1-VDD 28.56,93.34 v28.2,93.7 28.16,93.74 LED1.1-VDD | LED11.1-VDD 27.9,89.23 v27.9,90.7 | LED37.1-VDD 23.05,87.35 v23.1,87.3 | LED36.1-VDD 21.4,80.6 v23.1,80.6 24.44,81.94 LED12.1-VDD | v31.6,70.9 31.69,70.99 LED14.1-VDD | v37.3,65.5 37.39,65.59 LED15.1-VDD | LED16.1-VDD v41.2,59.6 40.5,58.9 v38.2,58.9 | LED32.1-VDD 37.25,59.85 v38.2,58.9 | v38.2,58.9 39.55,57.55 LED31.1-VDD | v41.9,53.6 41.94,53.64 LED17.1-VDD | LED18.1-VDD 42.86,48.5 v41.8,48.5 40.6,48.5 LED30.1-VDD | v40.8,41.8 40.84,41.84 LED19.1-VDD | v37.8,38.6 37.75,38.55 LED29.1-VDD | v35.6,36.3 36.86,36.3 LED20.1-VDD | v21.1,34.6 LED22.1-VDD | LED23.1-VDD 18.99,39.51 v18.8,39.7 18.8,41.2 LED27.1-VDD | v14.2,47.3 14.29,47.21 LED24.1-VDD | v12.5,55.2 12.64,55.06 LED25.1-VDD | LED26.1-VDD 21.14,50.5 v22.6,50.5 | v62.4,76.2 63.6,76.2 LED42.1-VDD | v60.8,69.2 62.1,69.2 LED43.1-VDD | v66.1,62.2 67.1,62.2 LED46.1-VDD | v59.5,62.3 60.7,62.3 LED45.1-VDD | v58.5,55.1 59.7,55.1 LED48.1-VDD | v64.6,55.1 65.8,55.1 LED47.1-VDD | v63.1,48.4 64.3,48.4 LED50.1-VDD | v59.6,48.1 59.55,48.05 LED49.1-VDD | v62.4,41.4 63.6,41.4 LED52.1-VDD
  Top 0.406: v55.8,41.5 57.2,41.5 LED51.1-VDD | v62.7,31.9 62.7,31.3 LED53.1-VDD | v69.7,31.9 69.7,31.1 LED54.1-VDD | v68.5,41.7 69.3,41.7 LED55.1-VDD | v74.9,41.9 75.2,41.9 LED56.1-VDD | v80.4,41.3 81.5,41.3 LED59.1-VDD | v86.1,41.3 87,41.3 LED60.1-VDD | v80.4,32.2 80.4,32.8 LED58.1-VDD | v73.6,31.9 73.6,33 LED57.1-VDD | LED61.1-VDD 85.5,48.3 v84.6,48.3 84.6,49.7 LED64.1-VDD | LED62.1-VDD 79.1,48.3 v78.5,48.3 78.5,49.9 LED63.1-VDD | v82.1,62.3 83.1,62.3 LED65.1-VDD | v88.6,62.3 89.5,62.3 LED66.1-VDD | v90.3,69.3 91.2,69.3 LED68.1-VDD | v83.8,69.4 84.6,69.4 LED67.1-VDD | v85.2,76.5 86,76.5 LED70.1-VDD | v91.4,76.4 92.5,76.4 LED69.1-VDD | v86.2,83.7 87.1,83.7 LED71.1-VDD | v93.3,83.6 93.9,83.6 LED72.1-VDD | v63.7,83.3 63.9,83.1 65.45,83.1 | v70.3,83.4 70.7,83 71.85,83 | v105.1,83.4 106,83.4 LED73.1-VDD | v111.2,83.1 112,83.1 LED74.1-VDD 112.75,82.15 v114.5,80.4 114.5,78.7 LED75.1-VDD | v103.3,76.3 104.5,76.3 LED109.1-VDD | LED108.1-VDD 104.5,69.1 105.9,69.1 107,70.2 111.9,70.2 v112.4,69.7 | LED110.1-VDD 111.95,70.15 v112.4,69.7 | v112.4,69.7 111.8,69.7 LED107.1-VDD | LED76.1-VDD 125.65,82.75 v126.5,83.6 126.5,82.9 LED77.1-VDD | LED78.1-VDD 135.6,77.5 v135.8,77.5 | v135.1,69.8 134.85,69.55 LED81.1-VDD | v128.8,70.1 127.4,70.1 LED80.1-VDD 127.15,72.25 LED79.1-VDD | v127.6,63.1 127.15,62.65 LED83.1-VDD | LED82.1-VDD 133,63 v134,63 | v126.1,56 125.95,55.85 LED84.1-VDD | v133.4,55.8 133.35,55.75 LED85.1-VDD | v124.9,49.1 124.65,48.85 LED86.1-VDD | v131.7,49 131.25,48.55 LED87.1-VDD | v130.1,41.9 129.65,41.45 LED88.1-VDD | v124.7,30.1 124.5,30.1 LED89.1-VDD | v122.9,36.6 122.8,36.6 LED91.1-VDD | v116.4,30.1 115.35,31.15 LED90.1-VDD
  Top 0.406: v115,39.3 113.85,38.15 LED92.1-VDD | v107,39.2 106.65,38.85 LED93.1-VDD | v104.9,31.4 104.65,31.15 LED94.1-VDD | v103,24.3 102.65,23.95 LED95.1-VDD | v96.4,24.4 96.25,24.25 LED98.1-VDD | v94.8,14.7 93.55,13.45 LED97.1-VDD | v102.3,14.8 102.3,14.6 LED96.1-VDD | v97.8,31.6 97.65,31.45 LED99.1-VDD | v100.2,39.2 99.75,38.75 LED100.1-VDD | v101.2,46.7 99.5,46.7 LED101.1-VDD | v108,46.6 106.6,46.6 LED102.1-VDD | v110,53.8 109.65,53.45 LED103.1-VDD | v102.5,54.1 102.05,53.65 LED104.1-VDD | v101.4,61.9 102.4,61.9 LED105.1-VDD | v108,61.8 109.3,61.8 LED106.1-VDD | v155.7,84.4 154.75,83.45 LED111.1-VDD | v161.8,84.3 160.95,83.45 LED112.1-VDD | v167.4,84.1 166.45,83.15 LED113.1-VDD | LED122.1-VDD 154.35,76.55 153.46,77.44 150.35,77.44 149.85,77.95 LED123.1-VDD 148.45,79.75 145.7,82.5 JP4.1 144.34,81.94 144.34,72.15 144.45,72.05 LED124.1-VDD 145.15,70.85 LED125.1-VDD | LED114.1-VDD 168.3,75.6 v167.7,75.6 167.3,75.2 163.8,75.2 162.25,73.65 LED121.1-VDD | v170.1,68.6 169.15,69.55 LED120.1-VDD | v170.1,68.6 170.95,69.45 LED115.1-VDD | v170.1,68.6 168.95,67.45 LED119.1-VDD | LED116.1-VDD 176.1,67.9 v176.8,67.9 | LED117.1-VDD 172.75,56.05 v173.8,55 | v163.4,61.4 164.55,60.25 LED118.1-VDD | LED129.1-VDD 158.45,53.95 v159.5,52.9 151.1,52.9 LED130.1-VDD 148.45,50.55 | 148.45,50.55 LED133.1-VDD | LED132.1-VDD 141.55,50.65 v142,51.1 142,51.3 LED131.1-VDD | v143.1,43.7 143.05,43.65 LED134.1-VDD | 148.45,50.55 147.85,49.95 LED135.1-VDD | LED128.1-VDD 153.6,63.5 v151.8,63.5 151.55,63.25 LED127.1-VDD | v146.9,31.6 146.15,32.35 LED136.1-VDD | LED137.1-VDD 154.9,30 v154.9,29.9 | v155.7,35.6 155.7,36.9 LED138.1-VDD
  Top 0.406: LED139.1-VDD 161.75,36.25 v162.6,37.1 162.15,37.55 LED140.1-VDD | v170.3,49.2 171,49.2 LED143.1-VDD | v169.3,41.1 168.2,41.1 LED141.1-VDD | v160.1,49.4 160.85,48.65 LED142.1-VDD | v177.7,38.1 177.95,37.85 LED144.1-VDD | v184.6,38.1 184.95,37.75 LED145.1-VDD | v179.8,45.3 180.9,45.3 LED146.1-VDD | v185.7,45.4 187,45.4 LED147.1-VDD | v181.4,52.6 182.4,52.6 LED148.1-VDD | v188.1,52.6 189.1,52.6 LED149.1-VDD | v182.7,60.1 183.9,60.1 LED150.1-VDD | v189.5,59.8 190.7,59.8 LED151.1-VDD | LED153.1-VDD 193.3,68 v193.3,69 193.95,69.65 LED158.1-VDD | v183.9,67.9 185.1,67.9 LED152.1-VDD | LED156.1-VDD v188.2,75.4 188,75.4 LED154.1-VDD | LED160.1-VDD 203.05,72.65 LED159.1-VDD 206.7,76.3 v206.7,77.3 206.05,77.95 LED161.1-VDD | LED155.1-VDD 189.9,83.5 v189.9,83.9 192.4,83.9 194.1,82.2 | 194.1,82.2 LED157.1-VDD | JP5.1 194.5,82.6 194.1,82.2 | LED33.1-VDD 26.85,63.95 v26.8,63.9 | v144.8,63.7 144.55,63.45 LED126.1-VDD | v34.3,94.8 34.3,96.26 LED2.1-VDD | v69.5,76.3 70.6,76.3 LED41.1-VDD | v23.5,91.4 LED38.1-VDD | v67.6,69.2 68.7,69.2 LED44.1-VDD
  pour Bottom: 0,108 0,0 210,0 210,108
GND  (via drill 0.35)
  Top 0.152: LED48.3-GND 58,51.1 58.6,51.1 v58.7,51 | LED71.3-GND 85.1,77.5 86.9,77.5 87.37,77.03 87.37,77 87.5,76.87 87.53,76.87 87.9,76.5 88.5,76.5 89.85,77.85 LED72.3-GND
  Top 0.406: v62,51.4 62.95,50.45 LED47.3-GND
  Bottom 0.152: v58.7,51 61.5,51
  Bottom 0.406: v62,51.4 61.6,51 61.5,51
  pour Top: 0,108 0,0 210,0 210,108
N$1
  Top 0.406: LED5.2-DOUT 53.01,83.21 53,83.2 53.91,82.29 LED6.4-DIN
N$2
  Top 0.406: LED1.2-DOUT 31.46,96.86 34.36,99.76 LED2.4-DIN
N$3
  Top 0.406: LED2.2-DOUT 40.35,99.01 LED3.4-DIN
N$4
  Top 0.406: LED3.2-DOUT 44.55,96.45 LED4.4-DIN
N$5
  Top 0.406: LED5.4-DIN 49.65,89.39 LED4.2-DOUT
N$6
  Top 0.406: LED7.4-DIN 49.2,80.2 49.2,79.11 LED6.2-DOUT
N$7
  Top 0.406: LED8.4-DIN 46.89,87.59 43.7,84.4 43.7,79.6 43.09,78.99 LED7.2-DOUT
N$8
  Top 0.406: LED8.2-DOUT 45.5,87.59 45.5,92.17 LED9.4-DIN
N$9
  Top 0.406: LED10.4-DIN 36.13,93.34 LED9.2-DOUT
N$10
  Top 0.406: LED10.2-DOUT 29.82,86.17 LED11.4-DIN
N$11
  Top 0.406: LED11.2-DOUT 26.6,87.23 26.6,82.7 27.36,81.94 LED12.4-DIN
N$12
  Top 0.406: LED12.2-DOUT 27.46,78.64 29.91,76.19 LED13.4-DIN
N$13
  Top 0.406: LED14.4-DIN 37.01,70.99 33.8,74.2 29.04,74.2 LED13.2-DOUT
N$14
  Top 0.406: LED14.2-DOUT 34.39,67.69 35.9,69.2 40.1,69.2 43.51,65.79 LED15.4-DIN
N$15
  Top 0.406: LED15.2-DOUT 41.11,62.29 42.8,60.6 46.59,60.6 LED16.4-DIN
N$16
  Top 0.406: LED17.4-DIN 47.16,53.64 44.51,56.29 LED16.2-DOUT
N$17
  Top 0.406: LED18.4-DIN 46.03,47.74 LED17.2-DOUT
N$18
  Top 0.406: LED19.4-DIN 46.22,41.84 LED18.2-DOUT
N$19
  Top 0.406: LED20.4-DIN 41.8,38.03 LED19.2-DOUT
N$20
  Top 0.406: LED21.4-DIN 35.35,34.59 LED20.2-DOUT
N$21
  Top 0.406: LED22.4-DIN 29.63,32.28 LED21.2-DOUT
N$22
  Top 0.406: LED22.2-DOUT 21.19,31.29 LED23.4-DIN
N$23
  Top 0.406: LED24.4-DIN 15.69,39.7 LED23.2-DOUT
N$24
  Top 0.406: LED24.2-DOUT 10.99,47.32 LED25.4-DIN
N$25
  Top 0.406: LED26.4-DIN 12.65,50.56 LED25.2-DOUT
N$26
  Top 0.406: LED26.2-DOUT 18.8,51.58 18.8,46.1 LED27.4-DIN
N$27
  Top 0.406: LED28.4-DIN 23.7,40.5 23.7,46.2 22.35,47.55 LED27.2-DOUT
N$28
  Top 0.406: LED28.2-DOUT 28.45,41.45 LED29.4-DIN
N$29
  Top 0.406: LED29.2-DOUT 38.75,44.35 LED30.4-DIN
N$30
  Top 0.406: LED30.2-DOUT 36.55,49.55 LED31.4-DIN
N$31
  Top 0.406: LED32.4-DIN 33.85,59.85 LED31.2-DOUT
N$32
  Top 0.406: LED33.4-DIN 28.25,70.35 35.45,63.15 LED32.2-DOUT
N$33
  Top 0.406: LED34.4-DIN 28.85,67.15 28.9,67.2 30.15,65.95 LED33.2-DOUT
N$34
  Top 0.406: LED35.4-DIN 19.85,72.05 LED34.2-DOUT
N$35
  Top 0.406: LED36.4-DIN 17.75,80.65 20.75,77.65 LED35.2-DOUT
N$36
  Top 0.406: LED37.4-DIN 17.95,87.35 LED36.2-DOUT
N$37
  Top 0.406: LED38.4-DIN 22.55,95.15 21.3,93.9 21.3,91 LED37.2-DOUT
N$38
  Top 0.406: LED38.2-DOUT 29.45,92.35 40.3,81.5 40.3,79.2 41.31,78.18 58.38,78.18 59.16,78.96 64.34,78.96 LED39.4-DIN
N$39
  Top 0.406: LED40.2-DOUT 70.4,80.9 71.3,80.9 73,79.2 73,73.1 LED41.4-DIN
N$40
  Top 0.406: LED42.2-DOUT 60.85,73.25 62.5,71.6 62.5,70.6 63.9,69.2 63.9,66.5 62.55,65.15 LED43.4-DIN
N$41  (via drill 0.35)
  Top 0.406: LED43.2-DOUT 61.3,66.7 v61.9,66.7 | v68,65.6 69.15,64.45 LED44.4-DIN
  Bottom 0.406: v61.9,66.7 63,65.6 v68,65.6
N$42
  Top 0.406: LED44.2-DOUT 65.85,67.05 64,65.2 64,63.4 62.7,62.1 62.7,58.3 LED45.4-DIN
N$43  (via drill 0.35)
  Top 0.406: LED46.4-DIN 65.3,59.1 v64.7,59.1 | v59.2,59.9 57.95,61.15 LED45.2-DOUT
  Bottom 0.406: v64.7,59.1 60,59.1 v59.2,59.9
N$44
  Top 0.406: LED47.4-DIN 66.25,52.45 68.4,54.6 68.4,59.6 67.8,60.2 65.8,60.2 LED46.2-DOUT
N$45
  Top 0.406: LED48.4-DIN 60.05,51.75 LED47.2-DOUT
N$46
  Top 0.406: LED49.4-DIN 54.7,46.6 54.1,46.6 53.6,47.1 53.6,51.6 LED48.2-DOUT
N$47  (via drill 0.35)
  Top 0.406: LED49.2-DOUT 57.3,45.6 v58.5,45.6 | v63.8,45.1 64.65,44.25 LED50.4-DIN
  Bottom 0.406: v58.5,45.6 63.3,45.6 v63.8,45.1
N$48
  Top 0.406: LED51.4-DIN 57.65,36.65 58.5,37.5 58.5,41.4 60,42.9 60,46.7 LED50.2-DOUT
N$49  (via drill 0.35)
  Top 0.406: LED51.2-DOUT 56.9,38.5 v57.7,38.5 | v63.5,37.9 64.05,37.35 LED52.4-DIN
  Bottom 0.406: v57.7,38.5 62.9,38.5 v63.5,37.9
N$50
  Top 0.406: LED53.4-DIN 59.2,32.7 59.2,39.4 LED52.2-DOUT
N$51
  Top 0.406: LED54.4-DIN 64.15,32.15 63.6,32.7 62.8,32.7 61.85,33.65 LED53.2-DOUT
N$52
  Top 0.406: LED54.2-DOUT 70.25,34.95 LED55.4-DIN
N$53  (via drill 0.35)
  Top 0.406: LED55.2-DOUT 69.6,38.1 v71.6,38.1 | v75.23,37.6 76.35,36.48 LED56.4-DIN
  Bottom 0.406: v71.6,38.1 74.6,38.1 75.1,37.6 v75.23,37.6
N$54
  Top 0.406: LED57.4-DIN 76.45,33.75 74.5,35.7 74.5,39.7 73.45,40.75 LED56.2-DOUT
N$55
  Top 0.406: LED57.2-DOUT 75.2,29.6 83.9,29.6 84.3,30 84.3,33 85.05,33.75 LED58.4-DIN
N$56
  Top 0.406: LED59.4-DIN 83.2,34.7 83.2,32.3 LED58.2-DOUT
N$57
  Top 0.406: LED60.4-DIN 84.8,38.6 80.3,38.6 78.75,40.15 LED59.2-DOUT
N$58
  Top 0.406: LED60.2-DOUT 84.35,40.95 LED61.4-DIN
N$59
  Top 0.406: LED62.4-DIN 79.75,44.55 LED61.2-DOUT
N$60
  Top 0.406: LED63.4-DIN 76.45,52.75 LED62.2-DOUT
N$61
  Top 0.406: LED63.2-DOUT 81.95,51.95 LED64.4-DIN
N$62
  Top 0.406: LED65.4-DIN 84.3,56.2 85.5,56.2 86.6,55.1 86.6,51.5 LED64.2-DOUT
N$63
  Top 0.406: LED41.2-DOUT 64.15,72.45 LED42.4-DIN
N$64
  Top 0.406: LED65.2-DOUT 82.8,59.3 88.2,59.3 90.05,57.45 LED66.4-DIN
N$65
  Top 0.406: LED67.4-DIN 86.75,62.35 LED66.2-DOUT
N$66
  Top 0.406: LED67.2-DOUT 84.3,66.4 89.4,66.4 91.75,64.05 LED68.4-DIN
N$67
  Top 0.406: LED69.4-DIN 91.6,72.4 89.1,72.4 88.3,71.6 88.3,68.9 LED68.2-DOUT
N$68
  Top 0.406: LED69.2-DOUT 89.65,74.35 LED70.4-DIN
N$69
  Top 0.406: LED71.4-DIN 86.3,79.6 84.3,79.6 83.15,78.45 LED70.2-DOUT
N$70
  Top 0.406: LED71.2-DOUT 86.9,80.6 92,80.6 LED72.4-DIN
N$71
  Top 0.406: LED72.2-DOUT 94.2,80 104.7,80 106.65,78.05 LED73.4-DIN
N$72
  Top 0.406: LED73.2-DOUT 105.8,80.3 110.6,80.3 112.75,78.15 LED74.4-DIN
N$73
  Top 0.406: LED74.2-DOUT 109.5,82.4 109.5,84.2 109.8,84.5 113.6,84.5 LED75.4-DIN
N$74
  Top 0.406: LED75.2-DOUT 115.9,76.5 122.5,76.5 123.85,77.85 LED76.4-DIN
N$75
  Top 0.406: LED76.2-DOUT 123.4,84.5 129.8,84.5 LED77.4-DIN
N$76
  Top 0.406: LED77.2-DOUT 129.45,78.65 130.6,79.8 135.9,79.8 136.6,79.1 136.6,73.1 135.15,71.65 LED78.4-DIN
N$77
  Top 0.406: LED39.2-DOUT 64.8,80.1 70.7,80.1 71.85,78.95 LED40.4-DIN
N$78
  Top 0.406: LED79.2-DOUT 123.65,72.05 122.7,71.1 122.7,68.6 126.35,64.95 LED80.4-DIN
N$79
  Top 0.406: LED82.4-DIN 132.55,59.15 135.4,62 135.4,65.7 131.55,69.55 LED81.2-DOUT
N$80
  Top 0.406: LED82.2-DOUT 126.05,59.35 LED83.4-DIN
N$81
  Top 0.406: LED83.2-DOUT 122.75,61.95 119.4,58.6 119.4,54.3 120.7,53 123.9,53 124.45,52.45 LED84.4-DIN
N$82  (via drill 0.35)
  Top 0.406: LED84.2-DOUT 123.2,53.8 v126.6,53.8 | v130.8,53.6 131.15,53.25 LED85.4-DIN
  Bottom 0.406: v126.6,53.8 126.8,53.6 v130.8,53.6
N$83
  Top 0.406: LED85.2-DOUT 127.85,53.85 129.1,52.6 129.1,50 127.9,48.8 127.9,46.8 126.3,45.2 123.6,45.2 123.05,44.65 LED86.4-DIN
N$84  (via drill 0.35)
  Top 0.406: LED87.4-DIN 128.2,45.3 v128.25,45.35 | v119.9,46.8 119.75,46.95 LED86.2-DOUT
  Bottom 0.406: v128.25,45.35 121.45,45.35 120,46.8 v119.9,46.8
N$85
  Top 0.406: LED88.4-DIN 125.1,39.9 123.7,39.9 123.2,40.4 123.2,42.1 122.7,42.6 121.6,42.6 121.6,44.9 125.07,48.37 125.2,48.37 125.39,48.55 LED87.2-DOUT
N$86
  Top 0.406: LED88.2-DOUT 128.4,38.2 129,38.2 129.6,37.6 129.6,35.2 127.2,32.8 119.8,32.8 LED89.4-DIN
N$87
  Top 0.406: LED89.2-DOUT 122.95,34.65 121.66,33.36 115.56,33.36 113.65,31.45 LED90.4-DIN
N$88
  Top 0.406: LED91.4-DIN 116.85,36.25 LED90.2-DOUT
N$89
  Top 0.406: LED91.2-DOUT 120.9,40.1 111,40.1 LED92.4-DIN
N$90
  Top 0.406: LED92.2-DOUT 113.4,40.9 110.5,40.9 108.6,39 108.1,39 107.1,38 107.1,35.7 LED93.4-DIN
N$91
  Top 0.406: LED94.4-DIN 101.24,28.46 101.24,34.85 101.4,35 101.4,38.2 LED93.2-DOUT
N$92
  Top 0.406: LED94.2-DOUT 100.5,30.8 100.5,27.9 102.3,26.1 102.3,25.4 102.6,25.1 103.8,25.1 103.8,21 101.85,19.05 LED95.4-DIN
N$93
  Top 0.406: LED95.2-DOUT 98.25,21.45 99.5,20.2 99.5,16.7 LED96.4-DIN
N$94
  Top 0.406: LED96.2-DOUT 97.8,13.4 97.8,12.9 97.3,12.4 89.6,12.4 LED97.4-DIN
N$95
  Top 0.406: LED97.2-DOUT 93.55,18.25 LED98.4-DIN
N$96
  Top 0.406: LED98.2-DOUT 92.5,25.4 95.1,25.4 LED99.4-DIN
N$97
  Top 0.406: LED99.2-DOUT 94.1,32.6 97,32.6 LED100.4-DIN
N$98
  Top 0.406: LED101.4-DIN 97.8,40.1 95.8,40.1 94.95,39.25 LED100.2-DOUT
N$99
  Top 0.406: LED102.4-DIN 104,43.8 98.6,43.8 LED101.2-DOUT
N$100
  Top 0.406: LED103.4-DIN 106.55,48.55 105.45,47.44 104.14,47.44 LED102.2-DOUT
N$101
  Top 0.406: LED104.4-DIN 100.95,49.55 LED103.2-DOUT
N$102
  Top 0.406: LED81.4-DIN 131,67.3 125.5,67.3 123.85,68.95 LED80.2-DOUT
N$103
  Top 0.406: LED104.2-DOUT 99.34,55.34 100.25,55.34 101.35,56.45 LED105.4-DIN
N$104
  Top 0.406: LED106.4-DIN 107.3,58.9 101.1,58.9 99.65,60.35 LED105.2-DOUT
N$105
  Top 0.406: LED106.2-DOUT 106.45,61.45 107.74,62.74 108.15,62.74 108.2,62.8 110.4,62.8 110.85,63.25 LED107.4-DIN
N$106
  Top 0.406: LED107.2-DOUT 107.55,67.25 LED108.4-DIN
N$107
  Top 0.406: LED109.4-DIN 103.8,69.8 102.8,69.8 102.4,69.4 102.4,69 102.05,68.65 LED108.2-DOUT
N$108
  Top 0.406: LED109.2-DOUT 104,73.5 105.6,73.5 107.05,72.05 LED110.4-DIN
N$109  (via drill 0.35)
  Top 0.406: LED110.2-DOUT 112.45,74.95 v113.8,73.6 | v155.4,77.1 154.25,78.25 LED111.4-DIN
  Bottom 0.406: v113.8,73.6 151.9,73.6 v155.4,77.1
N$110
  Top 0.406: LED111.2-DOUT 153.4,81 158,81 LED112.4-DIN
N$111
  Top 0.406: LED112.2-DOUT 159.4,81.2 164.6,81.2 166.15,79.65 LED113.4-DIN
N$112
  Top 0.406: LED113.2-DOUT 164.2,81.8 168.5,81.8 LED114.4-DIN
N$113
  Top 0.406: LED114.2-DOUT 171.45,75.45 LED115.4-DIN
N$114
  Top 0.406: LED115.2-DOUT 174.75,68.55 173.8,67.6 173.8,63.6 LED116.4-DIN
N$115
  Top 0.406: LED116.2-DOUT 171.95,66.65 170,64.7 170,57.9 168.35,56.25 LED117.4-DIN
N$116
  Top 0.406: LED78.2-DOUT 130.55,75.75 LED79.4-DIN
N$117
  Top 0.406: LED118.2-DOUT 161.55,61.95 163.6,64 167.1,64 LED119.4-DIN
N$118
  Top 0.406: LED121.4-DIN 158.65,73.05 160.1,71.6 167.2,71.6 LED120.2-DOUT
N$119
  Top 0.406: LED121.2-DOUT 160.4,74.5 156.4,74.5 154.35,72.45 LED122.4-DIN
N$120
  Top 0.406: LED122.2-DOUT 148.45,73.55 LED123.4-DIN
N$121  (via drill 0.35)
  Top 0.406: LED124.4-DIN 141.3,69.1 140.2,69.1 140,69.3 140,73.7 141.7,75.4 v143.1,75.4 | v145.3,75.5 145.15,75.65 LED123.2-DOUT
  Bottom 0.406: v143.1,75.4 145.3,75.4 v145.3,75.5
N$122
  Top 0.406: LED124.2-DOUT 143.9,68.1 150.5,68.1 LED125.4-DIN
N$123
  Top 0.406: LED125.2-DOUT 145.5,64.7 139.4,64.7 138.8,64.1 138.8,62.4 142.65,58.55 LED126.4-DIN
N$124
  Top 0.406: LED127.4-DIN 146.06,62.14 145.95,62.14 145.9,62.2 141.1,62.2 139.95,63.35 LED126.2-DOUT
N$125
  Top 0.406: LED128.4-DIN 156.9,61.4 148.4,61.4 LED127.2-DOUT
N$126
  Top 0.406: LED128.2-DOUT 155.7,58.1 155.7,56.5 LED129.4-DIN
N$127
  Top 0.406: LED129.2-DOUT 158.45,57.25 154.66,53.46 152.3,53.46 151.8,53.96 151.8,54 147,54 LED130.4-DIN
N$128
  Top 0.406: LED131.4-DIN 140.4,54.6 149.2,54.6 LED130.2-DOUT
N$129
  Top 0.406: LED131.2-DOUT 142.6,55.2 139.1,55.2 135.7,51.8 135.7,49.9 139.85,45.75 LED132.4-DIN
N$130
  Top 0.406: LED133.4-DIN 144.4,48.2 139,48.2 136.85,50.35 LED132.2-DOUT
N$131  (via drill 0.35)
  Top 0.406: LED133.2-DOUT 142.8,49.7 v142.3,49.7 | v141.5,40.6 141.5,38.8 LED134.4-DIN
  Bottom 0.406: v142.3,49.7 142.3,41.3 141.6,40.6 v141.5,40.6
N$132
  Top 0.406: LED134.2-DOUT 138.45,43.65 140.4,41.7 144.6,41.7 LED135.4-DIN
N$133
  Top 0.406: LED135.2-DOUT 148,39.9 148.7,39.9 149.2,39.4 149.2,37.5 148.7,37 147.1,37 147.05,37.06 145.25,37.06 145.2,37 144.4,37 141.25,33.85 LED136.4-DIN
N$134
  Top 0.406: LED136.2-DOUT 147.6,34.8 147.6,32.4 LED137.4-DIN
N$135
  Top 0.406: LED138.4-DIN 153.25,34.55 LED137.2-DOUT
N$136
  Top 0.406: LED139.4-DIN 158.9,33.4 158.9,39.6 158.25,40.25 LED138.2-DOUT
N$137
  Top 0.406: LED140.4-DIN 157.25,36.65 LED139.2-DOUT
N$138
  Top 0.406: LED141.4-DIN 164.4,40 162.9,40 162.15,40.75 LED140.2-DOUT
N$139
  Top 0.406: LED142.4-DIN 163.05,48.35 160.6,45.9 159.6,45.9 159.3,45.6 159.3,44.2 160,43.5 163.7,43.5 164.45,42.75 LED141.2-DOUT
N$140
  Top 0.406: LED143.4-DIN 168.9,46.4 162.2,46.4 LED142.2-DOUT
N$141
  Top 0.406: LED120.4-DIN 165.25,69.25 LED119.2-DOUT
N$142
  Top 0.406: LED143.2-DOUT 172.14,44.76 172.25,44.76 172.4,44.6 173.1,44.6 174.6,43.1 174.6,36 175.9,34.7 178.1,34.7 179.25,33.55 LED144.4-DIN
N$143
  Top 0.406: LED144.2-DOUT 178.5,35.3 183.7,35.3 LED145.4-DIN
N$144
  Top 0.406: LED146.4-DIN 182.85,38.45 LED145.2-DOUT
N$145
  Top 0.406: LED147.4-DIN 185.4,42.1 185.4,42.3 184.8,42.9 178.5,42.9 177.95,43.45 LED146.2-DOUT
N$146
  Top 0.406: LED148.4-DIN 184.15,45.95 LED147.2-DOUT
N$147
  Top 0.406: LED149.4-DIN 187.1,49.7 182,49.7 LED148.2-DOUT
N$148
  Top 0.406: LED150.4-DIN 186.25,52.85 LED149.2-DOUT
N$149
  Top 0.406: LED151.4-DIN 188.7,56.9 183.8,56.9 LED150.2-DOUT
N$150
  Top 0.406: LED151.2-DOUT 185.65,61.55 LED152.4-DIN
N$151
  Top 0.406: LED152.2-DOUT 184.7,65 190.3,65 LED153.4-DIN
N$152
  Top 0.406: LED153.2-DOUT 187.25,69.65 LED154.4-DIN
N$153
  Top 0.406: LED154.2-DOUT 185.1,75.8 187.1,75.8 LED155.4-DIN
N$154
  Top 0.406: LED155.2-DOUT 187.7,79.3 191.5,79.3 192.5,78.3 195.5,78.3 197.2,76.6 197.2,74.9 196.65,74.35 LED156.4-DIN
N$155
  Top 0.406: LED118.4-DIN 165.5,54.7 169,54.7 172.75,58.45 LED117.2-DOUT
N$156
  Top 0.406: LED161.4-DIN 201.15,76.35 LED160.2-DOUT
N$157
  Top 0.406: LED157.4-DIN 194.25,76.95 191.4,74.1 191.4,72.5 189.95,71.05 LED156.2-DOUT
N$158
  Top 0.406: LED158.4-DIN 198.1,71.7 198.1,77.4 195.8,79.7 192.8,79.7 190.95,81.55 LED157.2-DOUT
N$159
  Top 0.406: LED158.2-DOUT 196.8,67.9 203.2,67.9 LED159.4-DIN
N$160  (via drill 0.35)
  Top 0.406: LED160.4-DIN 196.4,73.2 196.9,73.2 v197.1,73.4 | v200.7,74.4 202.2,74.4 202.85,75.05 LED159.2-DOUT
  Bottom 0.406: v197.1,73.4 198.2,74.5 200.6,74.5 v200.7,74.4
SIGNALIN
  Top 0.406: JP6.1 23.69,104.8 LED1.4-DIN
SIGNALOUT
  Top 0.406: LED161.2-DOUT 206.05,104.25 JP7.1
(copper drawn outside any net)
  shapes: Top area x2